# Altium project Pi4GPU_v2.PrjPcb (part 2 of 2)

## Sheet [15] Sensors.SchDoc: Measurement sensors
size A4; Engineer: M. Folejewski; DocumentNumber: 15; SheetNumber: 15; SheetTotal: 17; PageSize: A4; Designators: 900-949
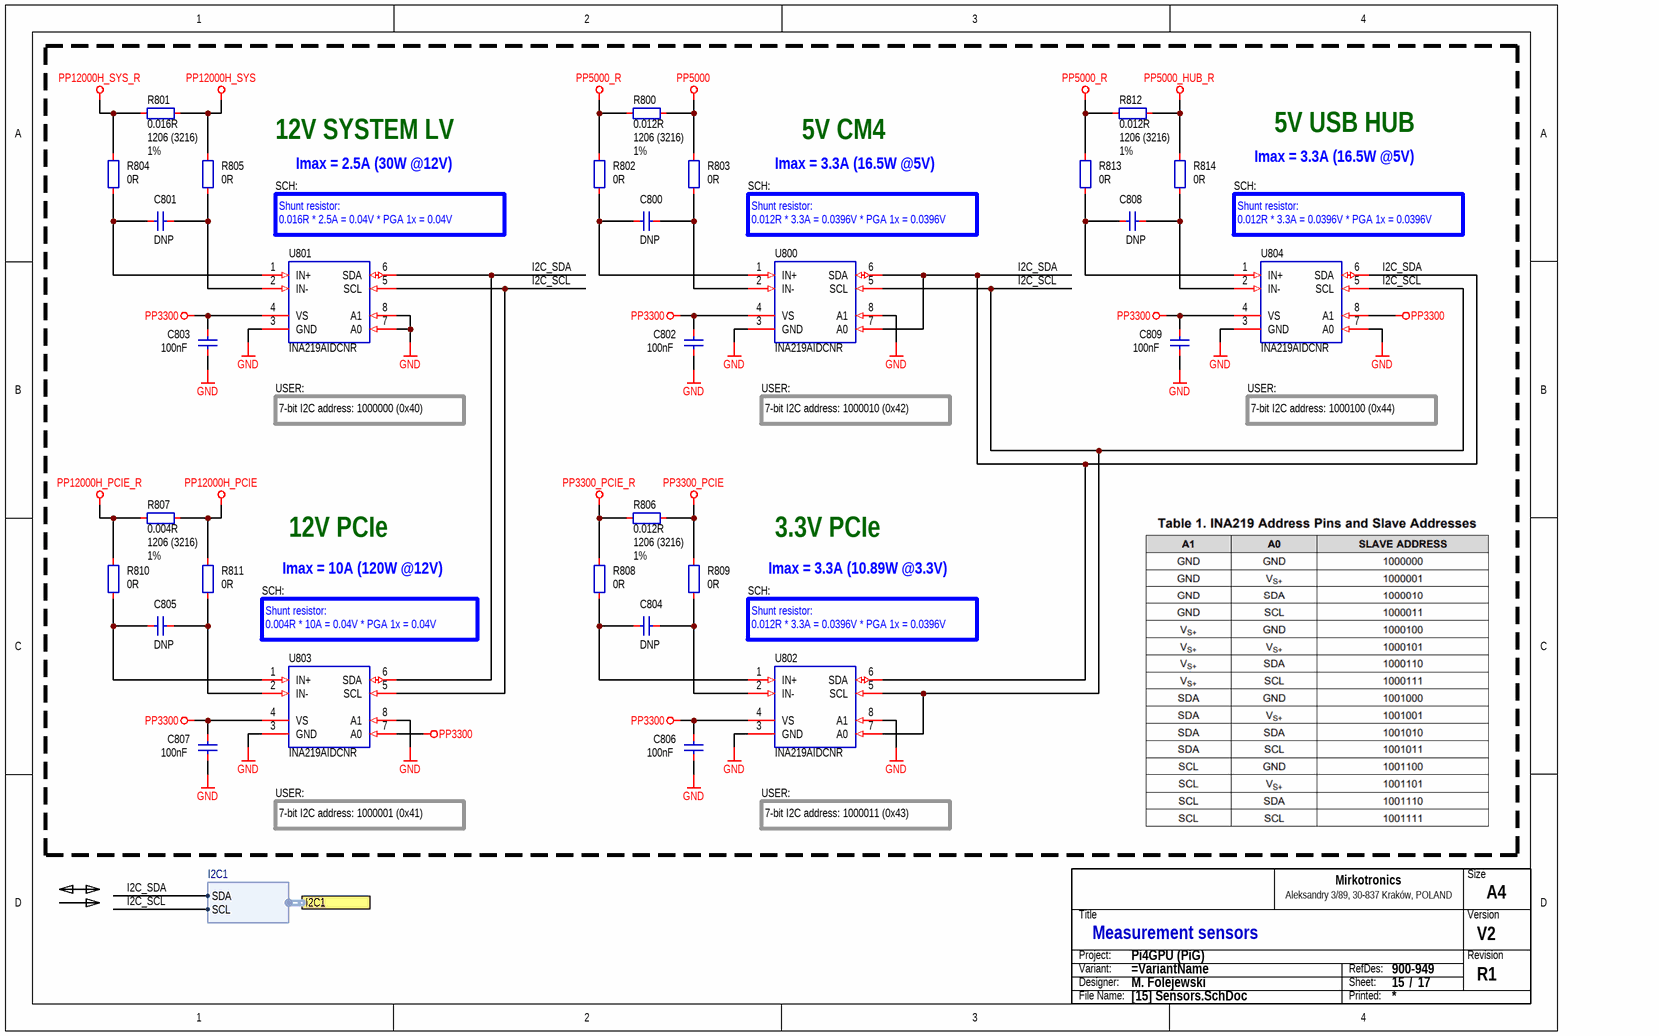
[diagram p10: [15] Sensors.SchDoc]

### Parts
(Parts that share a designator on the sheet are numbered #1, #2 ... from top to bottom, then left to right.)
C800  DNP  [CAP_0603_R]
C801  DNP  [CAP_0603_R]
C802  100nF  [CAP_0603_R]
C803  100nF  [CAP_0603_R]
C804  DNP  [CAP_0603_R]
C805  DNP  [CAP_0603_R]
C806  100nF  [CAP_0603_R]
C807  100nF  [CAP_0603_R]
C808  DNP  [CAP_0603_R]
C809  100nF  [CAP_0603_R]
R800  0.012R  Package (Case): 1206 (3216)  Tolerance: 1%  [RES_1206_R]
R801  0.016R  Package (Case): 1206 (3216)  Tolerance: 1%  [RES_1206_R]
R802  0R  [RES_0603_R]
R803  0R  [RES_0603_R]
R804  0R  [RES_0603_R]
R805  0R  [RES_0603_R]
R806  0.012R  Package (Case): 1206 (3216)  Tolerance: 1%  [RES_1206_R]
R807  0.004R  Package (Case): 1206 (3216)  Tolerance: 1%  [RES_1206_R]
R808  0R  [RES_0603_R]
R809  0R  [RES_0603_R]
R810  0R  [RES_0603_R]
R811  0R  [RES_0603_R]
R812  0.012R  Package (Case): 1206 (3216)  Tolerance: 1%  [RES_1206_R]
R813  0R  [RES_0603_R]
R814  0R  [RES_0603_R]
TB?#11  Title block  (value not drawn)  (graphical)
U800  INA219AIDCNR  [ICC_SOT23-8_290X160X100P65]
U801  INA219AIDCNR  [ICC_SOT23-8_290X160X100P65]
U802  INA219AIDCNR  [ICC_SOT23-8_290X160X100P65]
U803  INA219AIDCNR  [ICC_SOT23-8_290X160X100P65]
U804  INA219AIDCNR  [ICC_SOT23-8_290X160X100P65]

### Ports
I2C1 (harness I2C1)

### Harnesses
I2C1: SDA, SCL

### Nets
GND: C802.1 C803.1 C806.1 C807.1 C809.1 U800.3(GND) U800.8(A1) U801.3(GND) U801.7(A0) U801.8(A1) U802.3(GND) U802.8(A1) U803.3(GND) U803.8(A1) U804.3(GND) U804.7(A0)
PP3300: C802.2 C803.2 C806.2 C807.2 C809.2 U800.4(VS) U801.4(VS) U802.4(VS) U803.4(VS) U803.7(A0) U804.4(VS) U804.8(A1)
PP3300_PCIE: R806.2 R809.2
PP3300_PCIE_R: R806.1 R808.2
PP5000: R800.2 R803.2
PP5000_HUB_R: R812.2 R814.2
PP5000_R: R800.1 R802.2 R812.1 R813.2
PP12000H_PCIE: R807.2 R811.2
PP12000H_PCIE_R: R807.1 R810.2
PP12000H_SYS: R801.2 R805.2
PP12000H_SYS_R: R801.1 R804.2
I2C_SCL: U800.5(SCL) U801.5(SCL) U802.5(SCL) U802.7(A0) U803.5(SCL) U804.5(SCL) ; port I2C1.SCL  [project net CM_GPIO3]
I2C_SDA: U800.6(SDA) U800.7(A0) U801.6(SDA) U802.6(SDA) U803.6(SDA) U804.6(SDA) ; port I2C1.SDA  [project net CM_GPIO2]
NetC800_1: C800.1 R802.1 U800.1(IN+)
NetC800_2: C800.2 R803.1 U800.2(IN-)
NetC801_1: C801.1 R804.1 U801.1(IN+)
NetC801_2: C801.2 R805.1 U801.2(IN-)
NetC804_1: C804.1 R808.1 U802.1(IN+)
NetC804_2: C804.2 R809.1 U802.2(IN-)
NetC805_1: C805.1 R810.1 U803.1(IN+)
NetC805_2: C805.2 R811.1 U803.2(IN-)
NetC808_1: C808.1 R813.1 U804.1(IN+)
NetC808_2: C808.2 R814.1 U804.2(IN-)

### Notes on the sheet
- 12V SYSTEM LV
- Imax = 2.5A (30W @12V)
- Imax = 3.3A (16.5W @5V)
- 5V CM4
- 5V USB HUB
- (near U801) Shunt resistor:
  0.016R * 2.5A = 0.04V * PGA 1x = 0.04V
- SCH:
- Shunt resistor:
  0.012R * 3.3A = 0.0396V * PGA 1x = 0.0396V
- 7-bit I2C address: 1000000 (0x40)
- USER:
- 7-bit I2C address: 1000010 (0x42)
- 7-bit I2C address: 1000100 (0x44)
- Imax = 10A (120W @12V)
- 12V PCIe
- Imax = 3.3A (10.89W @3.3V)
- 3.3V PCIe
- Shunt resistor:
  0.004R * 10A = 0.04V * PGA 1x = 0.04V
- 7-bit I2C address: 1000001 (0x41)
- 7-bit I2C address: 1000011 (0x43)
- (in symbol SCH_TITLE_BLOCK_MIRKOTRONICS_V2) Size; Mirkotronics; Aleksandry 3/89, 30-837 Kraków, POLAND; Title; Version; Project:; Revision; Variant:; RefDes:; Designer:; Sheet:; /; File Name:; Printed:

### Library data of the parts
C800 C801 C804 C805 C808 = CAP-0023: as C450 on sheet [11] SD; ID: CAP-0023; Component Type: Capacitor; Component Subtype: MLCC; Value: DNP; Manufacturer: GENERIC; MPN: DNP; Mounting Type: SMD; Package (Case): 0603 (1608); Component Body: TBD; Component Height: TBD; Packaging Type: TBD; ROHS Status: TBD; Operating Temperature: TBD; Capacitance: DNP; Voltage Rating: TBD; Dielectric: TBD; Tolerance: TBD; Features: TBD; Supplier 1: LCSC
C802 C803 C806 C807 C809 = CAP-0008: as C200 on sheet [06] USB_C; Component Type: Capacitor; Component Subtype: MLCC; Value: 100nF; Manufacturer: TBD; MPN: TBD; Mounting Type: SMD; Package (Case): 0603 (1608); Supplier: ?; Supplier 1: LCSC; Supplier Part Number 1: C14663
R800 R801 R806 R807 R812 = RES-0060: Resistor; Thick Film; GENERIC; TBD; TBD; TBD; TBD; TBD; SMD; 1206 (3216);; ID: RES-0060; Component Type: Resistor; Component Subtype: Thick Film; Manufacturer: GENERIC; MPN: GENERIC; Mounting Type: SMD; Component Body: TBD; Component Height: TBD; Packaging Type: TBD; ROHS Status: TBD; Operating Temperature: TBD; Power Rating: TBD; TCR: TBD; Voltage Rating: TBD; Features: TBD; Supplier 1: LCSC
  R800 R806 R812: Value: 0.012R; Resistance: 0.012R; Supplier Part Number 1: C723448
  R801: Value: 0.016R; Resistance: 0.016R; Supplier Part Number 1: C2904218
  R807: Value: 0.004R; Resistance: 0.004R; Supplier Part Number 1: C5120913
R802-R805 R808-R811 R813 R814 = RES-0052: Resistor; Thick Film; 0R; 1%; TBD; TBD; TBD; Standard; SMD; 0603 (1608);; Component Body: 1.60 x 0.80mm; ID: RES-0052; Component Type: Resistor; Component Subtype: Thick Film; Value: 0R; Manufacturer: TBD; MPN: TBD; Mounting Type: SMD; Package (Case): 0603 (1608); Component Height: 0.45mm; Packaging Type: TBD; ROHS Status: TBD; Operating Temperature: TBD; Resistance: 0R; Tolerance: 1%; Power Rating: TBD; TCR: TBD; Voltage Rating: TBD; Features: Standard; Supplier 1: LCSC; Supplier Part Number 1: C21189
TB?#11 = SCH_TITLE_BLOCK_MIRKOTRONICS_V2: Component Type: Title block; Manufacturer: -; Mounting Type: Non component; MPN: -; Operating Temperature: -; Package: -; Specification: Title block; Value: Title block; Replacement: -; System: ?
U800-U804 = ICC_TXI_INA219_SOT23-8: IC; Current Monitor;; Manufacturer: Texas Instruments; Specification: Bidirectional Current/Power Monitor, I2C, SOT-23-8 package; Component Type: IC; Mounting Type: SMD; MPN: INA219AIDCNR; Operating Temperature: -40°C to +85°C; Package: SOT-23-8; Value: INA219AIDCNR; Component Subtype: Current monitor; Supplier 1: LCSC; Supplier Part Number 1: C87469

## Sheet [17] Changelog.SchDoc: Hardware changelog
size A4; Engineer: M. Folejewski; DocumentNumber: 17; SheetNumber: 17; SheetTotal: 17; PageSize: A4; Designators: -
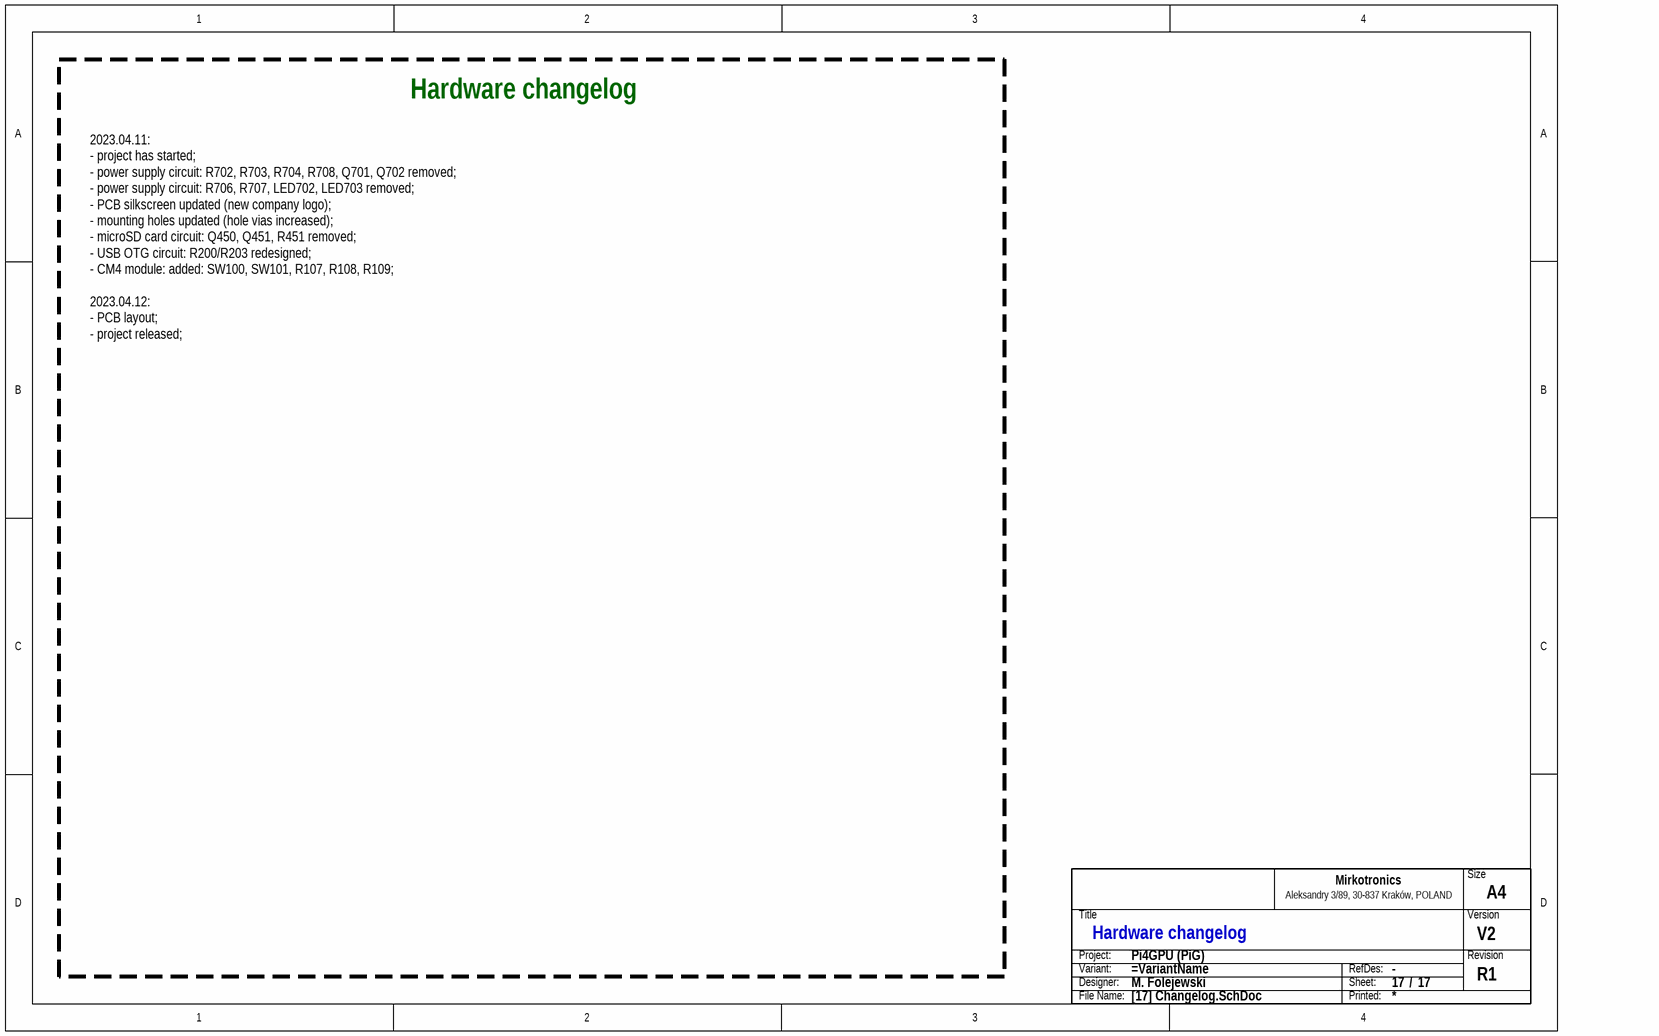
[diagram p11: [17] Changelog.SchDoc]

### Parts
(Parts that share a designator on the sheet are numbered #1, #2 ... from top to bottom, then left to right.)
TB?#12  Title block  (value not drawn)  (graphical)

### Notes on the sheet
- Hardware changelog
- 2023.04.11:
  - project has started;
  - power supply circuit: R702, R703, R704, R708, Q701, Q702 removed;
  - power supply circuit: R706, R707, LED702, LED703 removed;
  - PCB silkscreen updated (new company logo);
  - mounting holes updated (hole vias increased);
  - microSD card circuit: Q450, Q451, R451 removed;
  - USB OTG circuit: R200/R203 redesigned;
  - CM4 module: added: SW100, SW101, R107, R108, R109;
  2023.04.12:
  - PCB layout;
  - project released;
- (in symbol SCH_TITLE_BLOCK_MIRKOTRONICS_V2) Size; Mirkotronics; Aleksandry 3/89, 30-837 Kraków, POLAND; Title; Version; Project:; Revision; Variant:; RefDes:; Designer:; Sheet:; /; File Name:; Printed:

### Library data of the parts
TB?#12 = SCH_TITLE_BLOCK_MIRKOTRONICS_V2: Component Type: Title block; Manufacturer: -; Mounting Type: Non component; MPN: -; Operating Temperature: -; Package: -; Specification: Title block; Value: Title block; Replacement: -; System: ?

## Sheet [12] MISC.SchDoc: MISC
size A4; Engineer: M. Folejewski; DocumentNumber: 12; SheetNumber: 12; SheetTotal: 17; PageSize: A4; Designators: 800-899
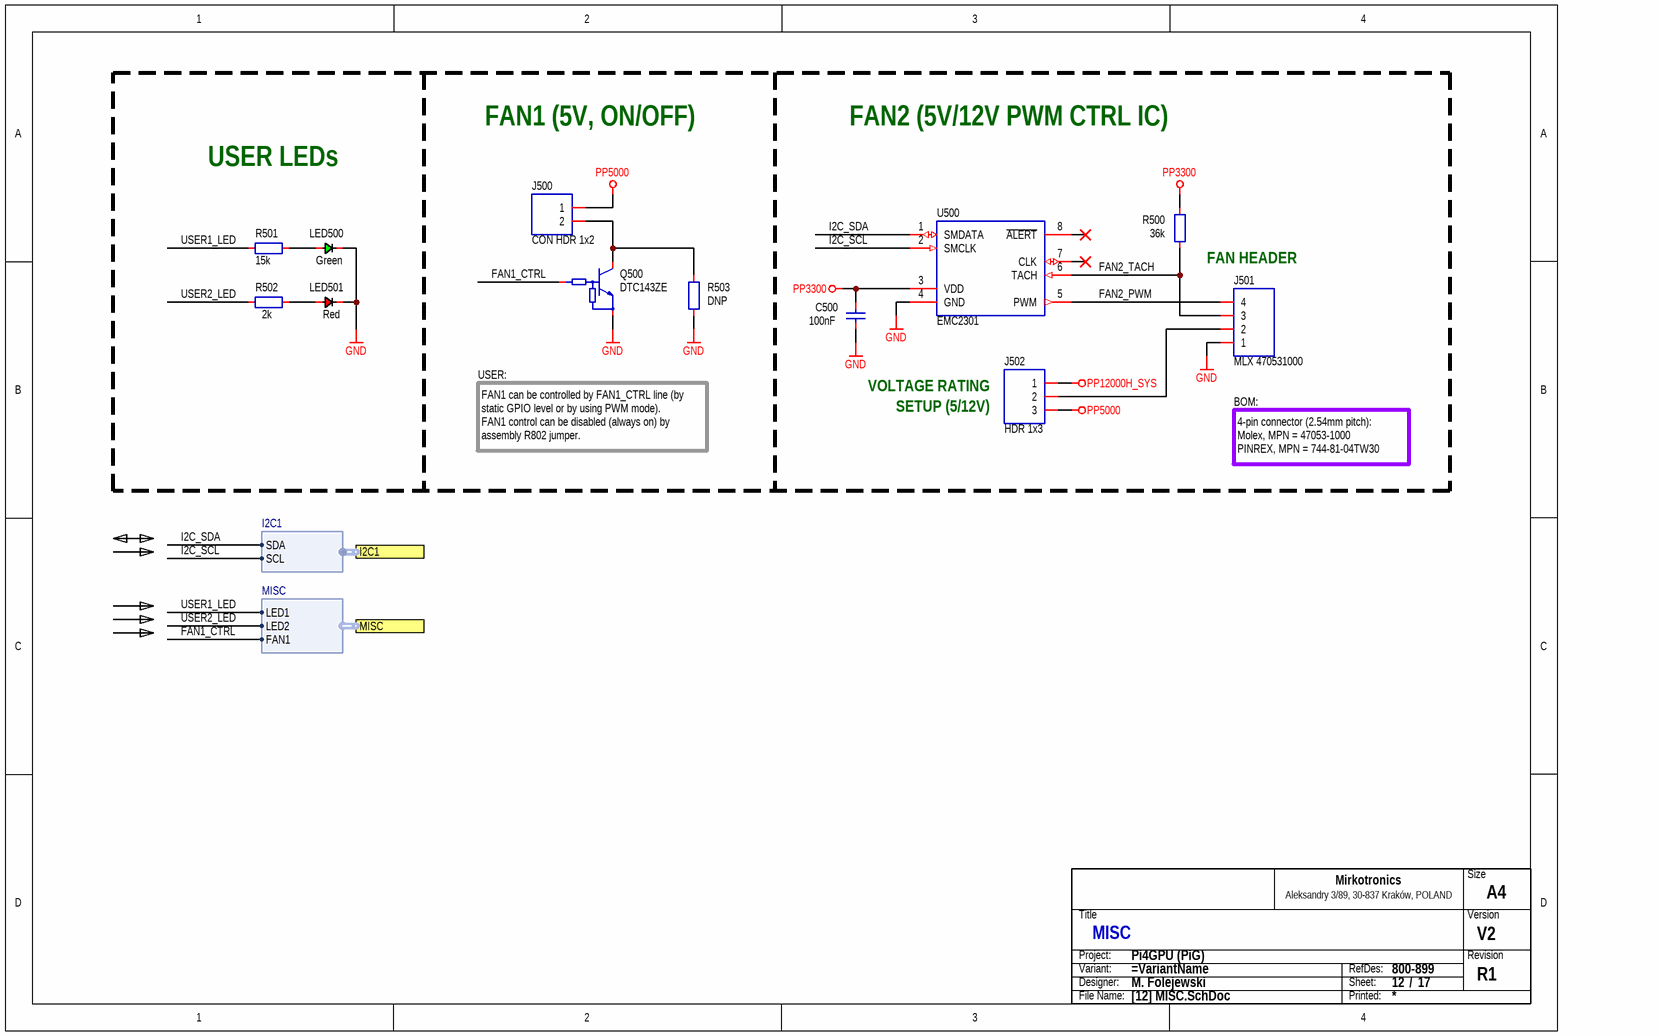
[diagram p12: [12] MISC.SchDoc]

### Parts
(Parts that share a designator on the sheet are numbered #1, #2 ... from top to bottom, then left to right.)
C500  100nF  [CAP_0603_R]
J500  CON HDR 1x2  [CON_HDR_P254_1X02_STR]
J501  MLX 470531000  [CON_MLX_470531000]
J502  HDR 1x3  [CON_HDR_P254_1X03_STR_JMP]
LED500  Green  [LED_0805_GRN_R]
LED501  Red  [LED_0805_RED_R]
Q500  DTC143ZE  [PKG_SOT523_SC75_SOT416_P100_R]
R500  36k  [RES_0603_R]
R501  15k  [RES_0603_R]
R502  2k  [RES_0603_R]
R503  DNP  [RES_0603_R]
TB?#13  Title block  (value not drawn)  (graphical)
U500  EMC2301  [ICC_TSSOP8_300X300X110P65]

### Ports
I2C1 (harness I2C1), MISC (harness MISC)

### Harnesses
MISC: LED1, LED2, FAN1
I2C1: SDA, SCL

### Nets
GND: C500.1 J501.1 LED500.1 LED501.1 Q500.2(E) R503.1 U500.4(GND)
PP3300: C500.2 R500.2 U500.3(VDD)
PP5000: J500.1 J502.3
PP12000H_SYS: J502.1
FAN1_CTRL: Q500.1(B) ; port MISC.FAN1  [project net CM_GPIO12]
FAN2_PWM: J501.4 U500.5(PWM)
FAN2_TACH: J501.3 R500.1 U500.6(TACH)
I2C_SCL: U500.2(SMCLK) ; port I2C1.SCL  [project net CM_GPIO3]
I2C_SDA: U500.1(SMDATA) ; port I2C1.SDA  [project net CM_GPIO2]
USER1_LED: R501.1 ; port MISC.LED1  [project net CM_GPIO22]
USER2_LED: R502.1 ; port MISC.LED2  [project net CM_GPIO27]
NetJ500_2: J500.2 Q500.3(C) R503.2
NetJ501_2: J501.2 J502.2
NetLED500_2: LED500.2 R501.2
NetLED501_2: LED501.2 R502.2

Not connected (* = marked no-connect by the designer): U500 7(CLK)* 8(~{ALERT})*

### Notes on the sheet
- USER LEDs
- FAN1 (5V, ON/OFF)
- FAN2 (5V/12V PWM CTRL IC)
- FAN HEADER
- USER:
- FAN1 can be controlled by FAN1_CTRL line (by static GPIO level or by using PWM mode).
  FAN1 control can be disabled (always on) by assembly R802 jumper.
- VOLTAGE RATING
- SETUP (5/12V)
- BOM:
- 4-pin connector (2.54mm pitch):
  Molex, MPN = 47053-1000
  PINREX, MPN = 744-81-04TW30
- (in symbol SCH_TITLE_BLOCK_MIRKOTRONICS_V2) Size; Mirkotronics; Aleksandry 3/89, 30-837 Kraków, POLAND; Title; Version; Project:; Revision; Variant:; RefDes:; Designer:; Sheet:; /; File Name:; Printed:

### Library data of the parts
C500 = CAP-0008: as C200 on sheet [06] USB_C; Component Type: Capacitor; Component Subtype: MLCC; Value: 100nF; Manufacturer: TBD; MPN: TBD; Mounting Type: SMD; Package (Case): 0603 (1608); Supplier: ?; Supplier 1: LCSC; Supplier Part Number 1: C14663
J500 = CON-0020: Connector; Pin Header; 1 x 2 pins; 2.54mm; Male; TBD; TBD; THT; THT;; Manufacturer: GENERIC; Component Type: Connector; Component Subtype: Pin Header; Value: CON HDR 1x2; MPN: GENERIC; Mounting Type: THT; Package (Case): THT; Supplier: ?; Supplier 1: LCSC; Supplier Part Number 1: C492401
J501 = CON_1X04_COL: Connector; 1 Row;; Manufacturer: Molex; Component Subtype: Pin header; Package (Case): THT; Component Type: Connector; Mounting Type: THT; MPN: 470531000; Value: MLX 470531000; Supplier 1: LCSC; Supplier Part Number 1: C402779
J502 = CON_1X03_COL: Connector; 1 Row;; Manufacturer: GENERIC; Component Subtype: Pin Header; Package (Case): THT; Value: HDR 1x3; MPN: GENERIC; Component Type: Connector; Mounting Type: THT; Supplier: ?; Supplier 1: LCSC; Supplier Part Number 1: C49257
LED500 = DIO_LED_GRN: as LED100 on sheet [04] CM4_PART1; Value: Green; Component Type: LED; Mounting Type: SMD; Supplier: LCSC; Supplier 1: LCSC; Supplier Part Number 1: C84260
LED501 = DIO_LED_RED: Diode; LED; Red;; Manufacturer: Foshan NationStar Optoelectronics; MPN: NCD0805R1; Component Subtype: LED Diode; Package (Case): 0805 (2012); Value: Red; Component Type: LED; Mounting Type: SMD; Supplier: LCSC; Supplier 1: LCSC; Supplier Part Number 1: C84256
Q500 = TRA_BJT_NPN_DIG_BEC: Transistor; BJT; NPN; Digital;; Component Subtype: NPN Transistor; Value: DTC143ZE; MPN: DTC143ZE; Component Type: Transistor; Mounting Type: SMD; Supplier: ?; Supplier 1: LCSC; Supplier Part Number 1: C248787
R500 R503 = RES-0054: as R300 on sheet [08] PCIe; Component Type: Resistor; Component Subtype: Thick Film; Manufacturer: GENERIC; MPN: GENERIC; Mounting Type: SMD; Package (Case): 0603 (1608); Supplier: ?; Supplier 1: LCSC
  R500: Value: 36k; Supplier Part Number 1: C23147
  R503: Value: DNP
R501 = RES-0043: as R105 on sheet [04] CM4_PART1; Component Type: Resistor; Component Subtype: Thick Film; Value: 15k; Mounting Type: SMD; Package (Case): 0603 (1608); Supplier: ?; Supplier 1: LCSC; Supplier Part Number 1: C22809
R502 = RES-0033: Resistor; Thick Film; 2k2; 1%; 100mW; 100PPM; 75V; Standard; SMD; 0603 (1608);; Manufacturer: Yageo Corporation; MPN: TBD; Component Type: Resistor; Component Subtype: Thick Film; Value: 2k; Mounting Type: SMD; Package (Case): 0603 (1608); Supplier: ?; Supplier 1: LCSC; Supplier Part Number 1: C22975
TB?#13 = SCH_TITLE_BLOCK_MIRKOTRONICS_V2: Component Type: Title block; Manufacturer: -; Mounting Type: Non component; MPN: -; Operating Temperature: -; Package: -; Specification: Title block; Value: Title block; Replacement: -; System: ?
U500 = ICC_MCP_EMC2301_MSOP-8: IC; Fan controller;; Manufacturer: Microchip Technology; MPN: EMC2301-1-ACZL-TR; Package (Case): MSOP-8; Component Subtype: Fan controller; Component Type: IC; Mounting Type: SMD; Value: EMC2301; Supplier 1: LCSC; Supplier Part Number 1: C148036

## Sheet [09] HDMI.SchDoc: HDMI Interface
size A4; Engineer: M. Folejewski; DocumentNumber: 9; SheetNumber: 9; SheetTotal: 17; PageSize: A4; Designators: 400-449
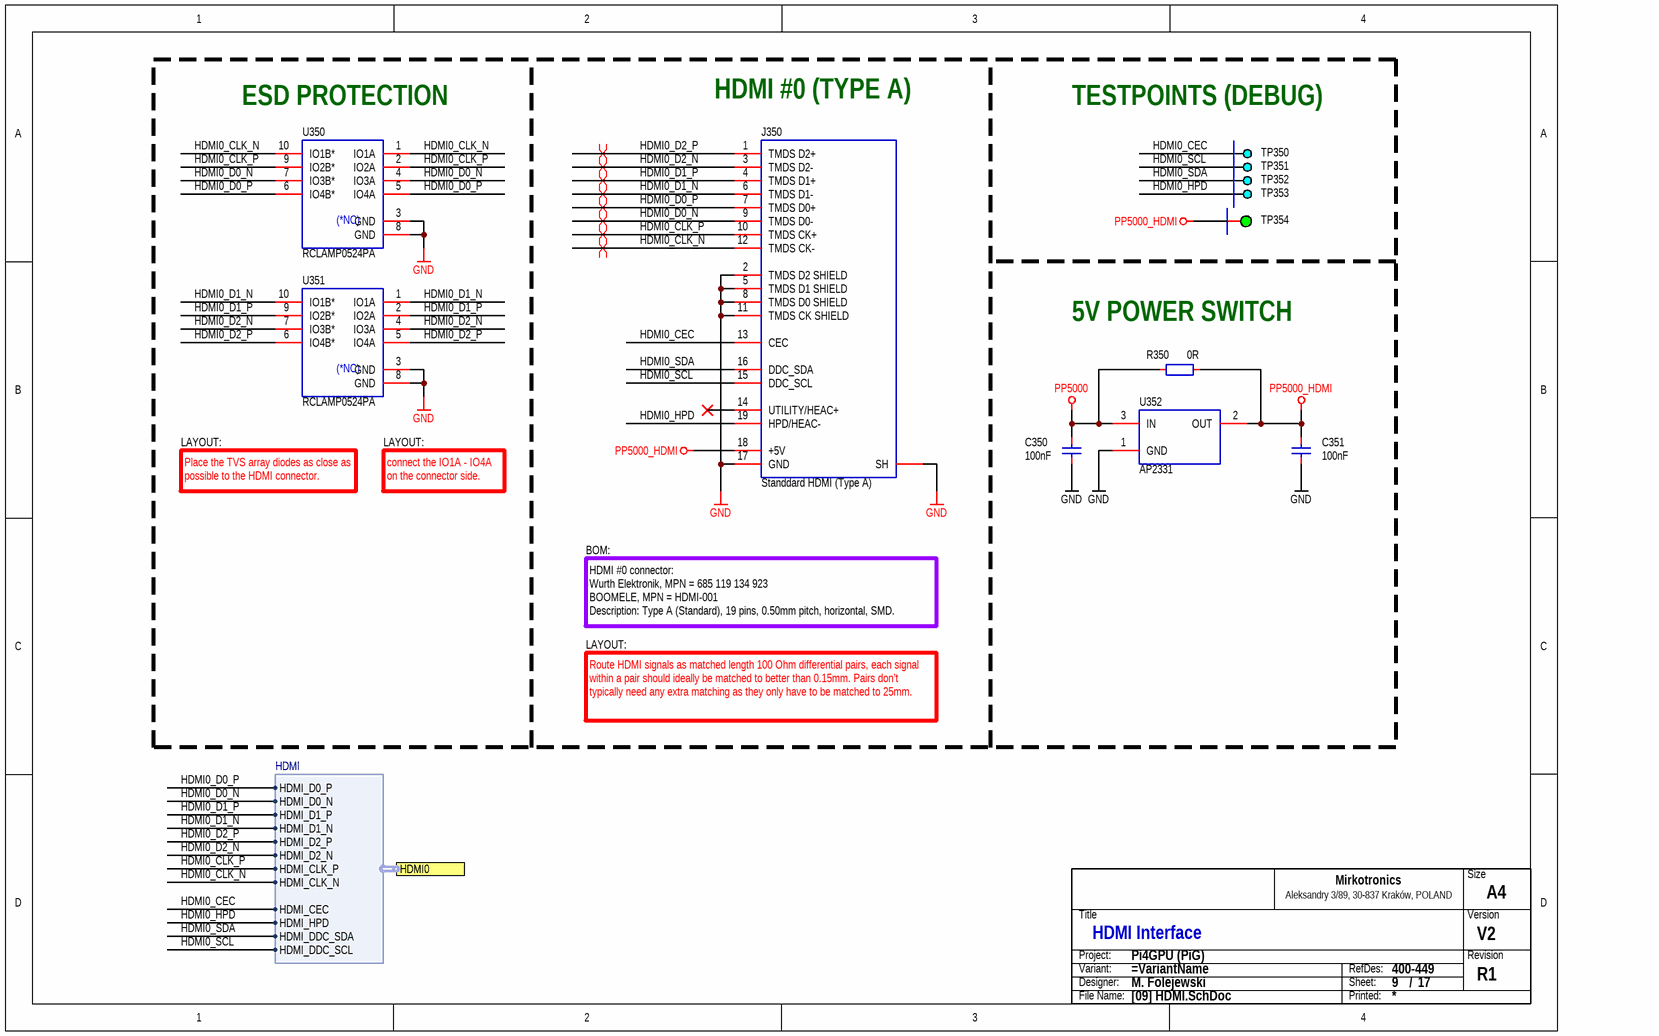
[diagram p13: [09] HDMI.SchDoc]

### Parts
(Parts that share a designator on the sheet are numbered #1, #2 ... from top to bottom, then left to right.)
C350  100nF  [CAP_0603_R]
C351  100nF  [CAP_0603_R]
J350  Standdard HDMI (Type A)  [CON_HDMI_STD]
R350  0R  [RES_0603_R]
TB?#14  Title block  (value not drawn)  (graphical)
TP350  DEBUG  [PCB_TP_DBG_50]  (value not drawn)  (no BOM)
TP351  DEBUG  [PCB_TP_DBG_50]  (value not drawn)  (no BOM)
TP352  DEBUG  [PCB_TP_DBG_50]  (value not drawn)  (no BOM)
TP353  DEBUG  [PCB_TP_DBG_50]  (value not drawn)  (no BOM)
TP354  ICT  [PCB_TP_ICT_100]  (value not drawn)  (no BOM)
U350  RCLAMP0524PA  [ICC_SLP2510P8_250X100X60_P50_R]
U351  RCLAMP0524PA  [ICC_SLP2510P8_250X100X60_P50_R]
U352  AP2331  [PKG_SOT23-3L_SC59_P190_R]

### Ports
HDMI0 (harness HDMI)

### Harnesses
HDMI: HDMI_D0_P, HDMI_D0_N, HDMI_D1_P, HDMI_D1_N, HDMI_CEC, HDMI_DDC_SDA, HDMI_D2_P, HDMI_D2_N, HDMI_CLK_P, HDMI_CLK_N, HDMI_DDC_SCL, HDMI_HPD

### Nets
GND: C350.1 C351.1 J350.2(TMDS_D2_SHIELD) J350.5(TMDS_D1_SHIELD) J350.8(TMDS_D0_SHIELD) J350.11(TMDS_CK_SHIELD) J350.17(GND) J350.SH U350.3(GND) U350.8(GND) U351.3(GND) U351.8(GND) U352.1(GND)
PP5000: C350.2 R350.2 U352.3(IN)
PP5000_HDMI: C351.2 J350.18(+5V) R350.1 TP354.1 U352.2(OUT)
HDMI0_CEC: J350.13(CEC) TP350.1 ; port HDMI0.HDMI_CEC  [project net CM_HDMI0_CEC]
HDMI0_CLK_N: J350.12(TMDS_CK-) U350.1(IO1A) U350.10(IO1B*) ; port HDMI0.HDMI_CLK_N  [project net CM_HDMI0_CLK_N]
HDMI0_CLK_P: J350.10(TMDS_CK+) U350.2(IO2A) U350.9(IO2B*) ; port HDMI0.HDMI_CLK_P  [project net CM_HDMI0_CLK_P]
HDMI0_D0_N: J350.9(TMDS_D0-) U350.4(IO3A) U350.7(IO3B*) ; port HDMI0.HDMI_D0_N  [project net CM_HDMI0_D0_N]
HDMI0_D0_P: J350.7(TMDS_D0+) U350.5(IO4A) U350.6(IO4B*) ; port HDMI0.HDMI_D0_P  [project net CM_HDMI0_D0_P]
HDMI0_D1_N: J350.6(TMDS_D1-) U351.1(IO1A) U351.10(IO1B*) ; port HDMI0.HDMI_D1_N  [project net CM_HDMI0_D1_N]
HDMI0_D1_P: J350.4(TMDS_D1+) U351.2(IO2A) U351.9(IO2B*) ; port HDMI0.HDMI_D1_P  [project net CM_HDMI0_D1_P]
HDMI0_D2_N: J350.3(TMDS_D2-) U351.4(IO3A) U351.7(IO3B*) ; port HDMI0.HDMI_D2_N  [project net CM_HDMI0_D2_N]
HDMI0_D2_P: J350.1(TMDS_D2+) U351.5(IO4A) U351.6(IO4B*) ; port HDMI0.HDMI_D2_P  [project net CM_HDMI0_D2_P]
HDMI0_HPD: J350.19(HPD/HEAC-) TP353.1 ; port HDMI0.HDMI_HPD  [project net CM_HDMI0_HPD]
HDMI0_SCL: J350.15(DDC_SCL) TP351.1 ; port HDMI0.HDMI_DDC_SCL  [project net CM_HDMI0_SCL]
HDMI0_SDA: J350.16(DDC_SDA) TP352.1 ; port HDMI0.HDMI_DDC_SDA  [project net CM_HDMI0_SDA]

Not connected (* = marked no-connect by the designer): J350 14(UTILITY/HEAC+)*

### Layout directives
differential pair: CM_HDMI0_CLK_N, CM_HDMI0_CLK_P, CM_HDMI0_D0_N, CM_HDMI0_D0_P, CM_HDMI0_D1_N, CM_HDMI0_D1_P, CM_HDMI0_D2_N, CM_HDMI0_D2_P

### Notes on the sheet
- (near U350) ESD PROTECTION
- (near J350) HDMI #0 (TYPE A)
- TESTPOINTS (DEBUG)
- (near R350) 5V POWER SWITCH
- LAYOUT:
- Place the TVS array diodes as close as possible to the HDMI connector.
- connect the IO1A - IO4A on the connector side.
- BOM:
- HDMI #0 connector:
  Wurth Elektronik, MPN = 685 119 134 923
  BOOMELE, MPN = HDMI-001
  Description: Type A (Standard), 19 pins, 0.50mm pitch, horizontal, SMD.
- Route HDMI signals as matched length 100 Ohm differential pairs, each signal within a pair should ideally be matched to better than 0.15mm. Pairs don’t typically need any extra matching as they only have to be matched to 25mm.
- (in symbol ICC-0005) (*NC)
- (in symbol SCH_TITLE_BLOCK_MIRKOTRONICS_V2) Size; Mirkotronics; Aleksandry 3/89, 30-837 Kraków, POLAND; Title; Version; Project:; Revision; Variant:; RefDes:; Designer:; Sheet:; /; File Name:; Printed:

### Library data of the parts
C350 C351 = CAP-0008: as C200 on sheet [06] USB_C; Component Type: Capacitor; Component Subtype: MLCC; Value: 100nF; Manufacturer: TBD; MPN: TBD; Mounting Type: SMD; Package (Case): 0603 (1608); Supplier: ?; Supplier 1: LCSC; Supplier Part Number 1: C14663
J350 = CON_HDMI_1.4+_A2: Connector; HDMI v1.4+;; MPN: HDMI-001; Manufacturer: BOOMELE; Package (Case): SMD; Value: Standdard HDMI (Type A); Component Subtype: HDMI (Type A); Component Type: Connector; Mounting Type: SMD; Supplier: ?; Supplier 1: LCSC; Supplier Part Number 1: C138388
R350 = RES-0054: as R300 on sheet [08] PCIe; Component Type: Resistor; Component Subtype: Thick Film; Value: 0R; Manufacturer: GENERIC; MPN: GENERIC; Mounting Type: SMD; Package (Case): 0603 (1608); Supplier: ?; Supplier 1: LCSC; Supplier Part Number 1: C21189
TB?#14 = SCH_TITLE_BLOCK_MIRKOTRONICS_V2: Component Type: Title block; Manufacturer: -; Mounting Type: Non component; MPN: -; Operating Temperature: -; Package: -; Specification: Title block; Value: Title block; Replacement: -; System: ?
TP350-TP353 = PCB_TP_DBG: PCB Marking; Test Point (Debug);; Value: DEBUG; Component Subtype: -; Component Type: Testpoint; Mounting Type: -; Supplier: ?
TP354 = PCB_TP_ICT: as TP112 on sheet [04] CM4_PART1; Component Type: Testpoint (for ICT); Manufacturer: -; Mounting Type: Non component; MPN: -; Value: ICT
U350 U351 = ICC-0005: as U201 on sheet [06] USB_C; Component Type: IC; Component Subtype: TVS Arrays; Value: RCLAMP0524PA; Mounting Type: SMD; Package (Case): TBD; Supplier: ?; Supplier 1: LCSC; Supplier Part Number 1: C40960
U352 = ICC-0008: IC; Power Switcher; TBD TBD; SMD; SC59;; Manufacturer: Diodes Incorporated; MPN: AP2331W-7; Component Type: IC; Component Subtype: Power Switcher; Value: AP2331; Mounting Type: SMD; Package (Case): SC59; Supplier: ?; Supplier 1: LCSC; Supplier Part Number 1: C460346

## Sheet [07] USB_HUB.SchDoc: 2-port USB 2.0 hub
size A4; Engineer: M. Folejewski; DocumentNumber: 7; SheetNumber: 7; SheetTotal: 17; PageSize: A4; Designators: 250-299
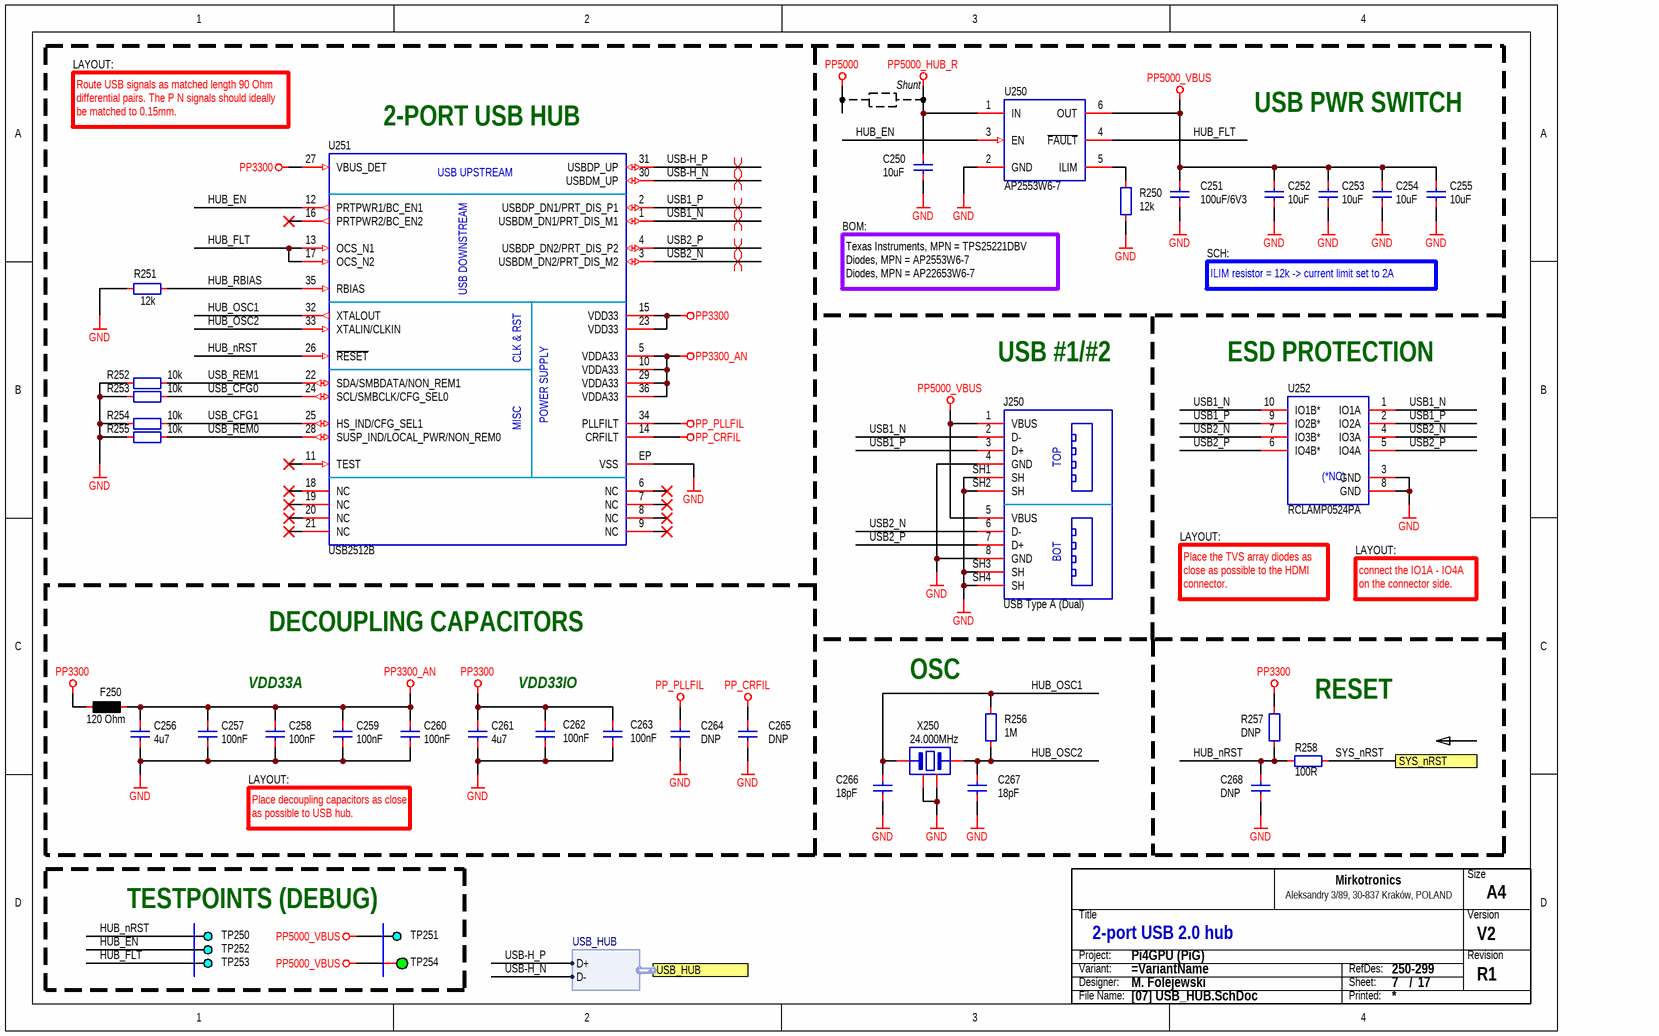
[diagram p14: [07] USB_HUB.SchDoc]

### Parts
(Parts that share a designator on the sheet are numbered #1, #2 ... from top to bottom, then left to right.)
C250  10uF  [CAP_0603_R]
C251  100uF/6V3  [CAP_1206_R]
C252  10uF  [CAP_0603_R]
C253  10uF  [CAP_0603_R]
C254  10uF  [CAP_0603_R]
C255  10uF  [CAP_0603_R]
C256  4u7  [CAP_0603_R]
C257  100nF  [CAP_0603_R]
C258  100nF  [CAP_0603_R]
C259  100nF  [CAP_0603_R]
C260  100nF  [CAP_0603_R]
C261  4u7  [CAP_0603_R]
C262  100nF  [CAP_0603_R]
C263  100nF  [CAP_0603_R]
C264  DNP  [CAP_0603_R]
C265  DNP  [CAP_0603_R]
C266  18pF  [CAP_0603_R]
C267  18pF  [CAP_0603_R]
C268  DNP  [CAP_0603_R]
F250  120 Ohm  [FER_0603_R]
J250  USB Type A (Dual)  [CON_USB_TYPE_A_2X]
R250  12k  [RES_0603_R]
R251  12k  [RES_0603_R]
R252  10k  [RES_0603_R]
R253  10k  [RES_0603_R]
R254  10k  [RES_0603_R]
R255  10k  [RES_0603_R]
R256  1M  [RES_0603_R]
R257  DNP  [RES_0603_R]
R258  100R  [RES_0603_R]
TB?#15  Title block  (value not drawn)  (graphical)
TP250  DEBUG  [PCB_TP_DBG_50]  (value not drawn)  (no BOM)
TP251  DEBUG  [PCB_TP_DBG_50]  (value not drawn)  (no BOM)
TP252  DEBUG  [PCB_TP_DBG_50]  (value not drawn)  (no BOM)
TP253  DEBUG  [PCB_TP_DBG_50]  (value not drawn)  (no BOM)
TP254  ICT  [PCB_TP_ICT_100]  (value not drawn)  (no BOM)
U250  AP2553W6-7  [PKG_SOT23-6]
U251  USB2512B  [ICC_QFN36_600X600X100_P50_EP_R]
U252  RCLAMP0524PA  [ICC_SLP2510P8_250X100X60_P50_R]
X250  24.000MHz  [OSC_3225_4P_R]

### Ports
SYS_nRST, USB_HUB (harness USB_HUB)

### Harnesses
USB_HUB: D+, D-

### Nets
GND: C250.1 C251.1 C252.1 C253.1 C254.1 C255.1 C256.1 C257.1 C258.1 C259.1 C260.1 C261.1 C262.1 C263.1 C264.1 C265.1 C266.1 C267.1 C268.1 J250.4(GND) J250.8(GND) J250.SH1(SH) J250.SH2(SH) J250.SH3(SH) J250.SH4(SH) R250.1 R251.1 R252.1 R253.1 R254.1 R255.1 U250.2(GND) U251.EP(VSS) U252.3(GND) U252.8(GND) X250.2 X250.4
PP3300: C261.2 C262.2 C263.2 F250.1 R257.2 U251.15(VDD33) U251.23(VDD33) U251.27(VBUS_DET)
PP3300_AN: C256.2 C257.2 C258.2 C259.2 C260.2 F250.2 U251.5(VDDA33) U251.10(VDDA33) U251.29(VDDA33) U251.36(VDDA33)
PP5000_HUB_R: C250.2 U250.1(IN)
PP5000_VBUS: C251.2 C252.2 C253.2 C254.2 C255.2 J250.1(VBUS) J250.5(VBUS) TP251.1 TP254.1 U250.6(OUT)
PP_CRFIL: C265.2 U251.14(CRFILT)
PP_PLLFIL: C264.2 U251.34(PLLFILT)
HUB_EN: TP252.1 U250.3(EN) U251.12(PRTPWR1/BC_EN1)
HUB_FLT: TP253.1 U250.4(~{FAULT}) U251.13(OCS_N1) U251.17(OCS_N2)
HUB_nRST: C268.2 R257.1 R258.1 TP250.1 U251.26(~{RESET})
HUB_OSC1: C266.2 R256.2 U251.32(XTALOUT) X250.1
HUB_OSC2: C267.2 R256.1 U251.33(XTALIN/CLKIN) X250.3
HUB_RBIAS: R251.2 U251.35(RBIAS)
SYS_nRST: R258.2 ; port SYS_nRST
USB1_N: J250.2(D-) U251.1(USBDM_DN1/PRT_DIS_M1) U252.1(IO1A) U252.10(IO1B*)
USB1_P: J250.3(D+) U251.2(USBDP_DN1/PRT_DIS_P1) U252.2(IO2A) U252.9(IO2B*)
USB2_N: J250.6(D-) U251.3(USBDM_DN2/PRT_DIS_M2) U252.4(IO3A) U252.7(IO3B*)
USB2_P: J250.7(D+) U251.4(USBDP_DN2/PRT_DIS_P2) U252.5(IO4A) U252.6(IO4B*)
USB-H_N: U251.30(USBDM_UP) ; port USB_HUB.D-
USB-H_P: U251.31(USBDP_UP) ; port USB_HUB.D+
USB_CFG0: R253.2 U251.24(SCL/SMBCLK/CFG_SEL0)
USB_CFG1: R254.2 U251.25(HS_IND/CFG_SEL1)
USB_REM0: R255.2 U251.28(SUSP_IND/LOCAL_PWR/NON_REM0)
USB_REM1: R252.2 U251.22(SDA/SMBDATA/NON_REM1)
NetR250_2: R250.2 U250.5(ILIM)

Not connected (* = marked no-connect by the designer): U251 6(NC)* 7(NC)* 8(NC)* 9(NC)* 11(TEST)* 16(PRTPWR2/BC_EN2)* 18(NC)* 19(NC)* 20(NC)* 21(NC)*

### Layout directives
differential pair: USB1_N, USB1_P, USB2_N, USB2_P, USB-H_N, USB-H_P

### Notes on the sheet
- LAYOUT:
- Shunt
- USB PWR SWITCH
- Route USB signals as matched length 90 Ohm differential pairs. The P N signals should ideally be matched to 0.15mm.
- (near U251) 2-PORT USB HUB
- BOM:
- Texas Instruments, MPN = TPS25221DBV
  Diodes, MPN = AP2553W6-7
  Diodes, MPN = AP22653W6-7
- ILIM resistor = 12k -> current limit set to 2A
- SCH:
- USB #1/#2
- (near U252) ESD PROTECTION
- DECOUPLING CAPACITORS
- Place the TVS array diodes as close as possible to the HDMI connector.
- connect the IO1A - IO4A on the connector side.
- VDD33A
- VDD33IO
- (near R256) OSC
- RESET
- Place decoupling capacitors as close as possible to USB hub.
- TESTPOINTS (DEBUG)
- (in symbol CON-0009) TOP; BOT
- (in symbol ICC-0005) (*NC)
- (in symbol ICC_MCP_USB2512B_QFN36) USB UPSTREAM; USB DOWNSTREAM; CLK & RST; POWER SUPPLY; MISC
- (in symbol SCH_TITLE_BLOCK_MIRKOTRONICS_V2) Size; Mirkotronics; Aleksandry 3/89, 30-837 Kraków, POLAND; Title; Version; Project:; Revision; Variant:; RefDes:; Designer:; Sheet:; /; File Name:; Printed:

### Library data of the parts
C250 C252-C256 C261 = CAP-0023: Capacitor; MLCC; GENERIC; TBD; TBD; TBD; TBD; SMD; 0603 (1608);; Component Type: Capacitor; Component Subtype: MLCC; Manufacturer: GENERIC; MPN: GENERIC; Mounting Type: SMD; Package (Case): 0603 (1608); Supplier: ?; Supplier 1: LCSC
  C250 C252-C255: Value: 10uF; Supplier Part Number 1: C19702
  C256 C261: Value: 4u7; Supplier Part Number 1: C19666
C251 = CAP-0025: Capacitor; MLCC; GENERIC; TBD; TBD; TBD; TBD; SMD; 1206 (3216);; Component Type: Capacitor; Component Subtype: MLCC; Value: 100uF/6V3; Manufacturer: GENERIC; MPN: GENERIC; Mounting Type: SMD; Package (Case): 1206 (3216); Supplier: ?; Supplier 1: LCSC; Supplier Part Number 1: C15008
C257-C260 C262 C263 = CAP-0008: Capacitor; MLCC; 100nF; TBD; TBD; TBD; TBD; SMD; 0603 (1608);; Component Type: Capacitor; Component Subtype: MLCC; Value: 100nF; Manufacturer: TBD; MPN: TBD; Mounting Type: SMD; Package (Case): 0603 (1608); Supplier: ?; Supplier 1: LCSC; Supplier Part Number 1: C14663
C264 C265 C268 = CAP-0018: Capacitor; MLCC; DNP; TBD; TBD; TBD; DO NOT PLACE; SMD; 0603 (1608);; Component Type: Capacitor; Component Subtype: MLCC; Value: DNP; Manufacturer: DNP; MPN: DNP; Mounting Type: SMD; Package (Case): 0603 (1608); Supplier: ?; Supplier 1: LCSC
C266 C267 = CAP-0020: Capacitor; MLCC; 18pF; TBD; TBD; TBD; TBD; SMD; 0603 (1608);; Component Type: Capacitor; Component Subtype: MLCC; Value: 18pF; Manufacturer: TBD; MPN: TBD; Mounting Type: SMD; Package (Case): 0603 (1608); Supplier: ?; Supplier 1: LCSC; Supplier Part Number 1: C1647
F250 = FIL-0001: Inductor; Ferrite Bead; 120 Ohm; 2000mA; TBD; TBD; TBD; SMD; 0603 (1608);; Component Type: Inductor; Component Subtype: Ferrite Bead; Value: 120 Ohm; Manufacturer: TBD; MPN: TBD; Mounting Type: SMD; Package (Case): 0603 (1608); Supplier: ?; Supplier 1: LCSC; Supplier Part Number 1: C62708
J250 = CON-0009: Connector; USB Type A (Dual); 2 x 4 pins; TBD; TBD; TBD; TBD; THT; THT;; Component Type: Connector; Component Subtype: USB Type A (Dual); Value: USB Type A (Dual); Manufacturer: TBD; MPN: TBD; Mounting Type: THT; Package (Case): THT; Supplier: ?; Supplier 1: LCSC; Supplier Part Number 1: C456021
R250 = RES-0054: Resistor; Thick Film; GENERIC; TBD; TBD; TBD; TBD; TBD; SMD; 0603 (1608);; Component Type: Resistor; Component Subtype: Thick Film; Value: 12k; Manufacturer: GENERIC; MPN: GENERIC; Mounting Type: SMD; Package (Case): 0603 (1608); Supplier: ?; Supplier 1: LCSC; Supplier Part Number 1: C22790
R251 = RES-0053: Resistor; Thick Film; 12k; 1%; 100mW; 100PPM; 75V; Standard; SMD; 0603 (1608);; Manufacturer: Yageo Corporation; MPN: TBD; Component Type: Resistor; Component Subtype: Thick Film; Value: 12k; Mounting Type: SMD; Package (Case): 0603 (1608); Supplier: ?; Supplier 1: LCSC; Supplier Part Number 1: C22790
R252-R255 = RES-0028: Resistor; Thick Film; 10k; 1%; 100mW; 100PPM; 75V; Standard; SMD; 0603 (1608);; Manufacturer: Yageo Corporation; MPN: RC0603FR-0710KL; Component Type: Resistor; Component Subtype: Thick Film; Value: 10k; Mounting Type: SMD; Package (Case): 0603 (1608); Supplier: ?; Supplier 1: LCSC; Supplier Part Number 1: C98220
R256 = RES-0050: Resistor; Thick Film; 1M; 1%; 100mW; 100PPM; 75V; Standard; SMD; 0603 (1608);; Manufacturer: Yageo Corporation; MPN: TBD; Component Type: Resistor; Component Subtype: Thick Film; Value: 1M; Mounting Type: SMD; Package (Case): 0603 (1608); Supplier: ?; Supplier 1: LCSC; Supplier Part Number 1: C22935
R257 = RES-0051: Resistor; Thick Film; DNP; TBD; TBD; TBD; TBD; DO NOT PLACE; SMD; 0603 (1608);; Component Type: Resistor; Component Subtype: Thick Film; Value: DNP; Manufacturer: TBD; MPN: TBD; Mounting Type: SMD; Package (Case): 0603 (1608); Supplier: ?; Supplier 1: LCSC
R258 = RES-0026: Resistor; Thick Film; 100R; 1%; 100mW; 100PPM; 75V; Standard; SMD; 0603 (1608);; Manufacturer: Yageo Corporation; MPN: TBD; Component Type: Resistor; Component Subtype: Thick Film; Value: 100R; Mounting Type: SMD; Package (Case): 0603 (1608); Supplier: ?; Supplier 1: LCSC; Supplier Part Number 1: C22775
TB?#15 = SCH_TITLE_BLOCK_MIRKOTRONICS_V2: Component Type: Title block; Manufacturer: -; Mounting Type: Non component; MPN: -; Operating Temperature: -; Package: -; Specification: Title block; Value: Title block; Replacement: -; System: ?
TP250-TP253 = PCB_TP_DBG: PCB Marking; Test Point (Debug);; Value: DEBUG; Component Subtype: -; Component Type: Testpoint; Mounting Type: -; Supplier: ?
TP254 = PCB_TP_ICT: Test Point (ICT); Specification: Testpoint (for ICT), SMD pad; Component Type: Testpoint (for ICT); Manufacturer: -; Mounting Type: Non component; MPN: -; Value: ICT
U250 = ICC_TXI_TPS25221_DBV: IC; Current Limited Switch;; Manufacturer: Diodes Incorporated; Package (Case): SOT26; MPN: AP2553W6-7; Value: AP2553W6-7; Component Subtype: Current Limited Switch; Component Type: IC; Mounting Type: SMD; Supplier: ?; Supplier 1: LCSC; Supplier Part Number 1: C212302
U251 = ICC_MCP_USB2512B_QFN36: IC; USB Hub;; Manufacturer: Microchip Technology; Component Subtype: USB Hub; Component Type: IC; Mounting Type: SMD; MPN: USB2512B; Supplier: ?; Value: USB2512B; Supplier 1: LCSC; Supplier Part Number 1: C626658
U252 = ICC-0005: IC; TVS Arrays; ESD Protection; 4-Channel; 17kV Air; 12kV Contact; 0.3pF Capitance; TBD; SMD; TBD;; Manufacturer: Semtech Corporation; MPN: RCLAMP0524PATCT; Component Type: IC; Component Subtype: TVS Arrays; Value: RCLAMP0524PA; Mounting Type: SMD; Package (Case): TBD; Supplier: ?; Supplier 1: LCSC; Supplier Part Number 1: C40960
X250 = OSC_XTL_P4: Oscillator; Crystal;; Value: 24.000MHz; Component Subtype: Crystal; Component Type: Crystal; Mounting Type: SMD; Supplier: ?; Supplier 1: LCSC; Supplier Part Number 1: C5261153

## Sheet [13] PWR1.SchDoc: Power supply
size A4; Engineer: M. Folejewski; DocumentNumber: 13; SheetNumber: 13; SheetTotal: 17; PageSize: A4; Designators: 900-949
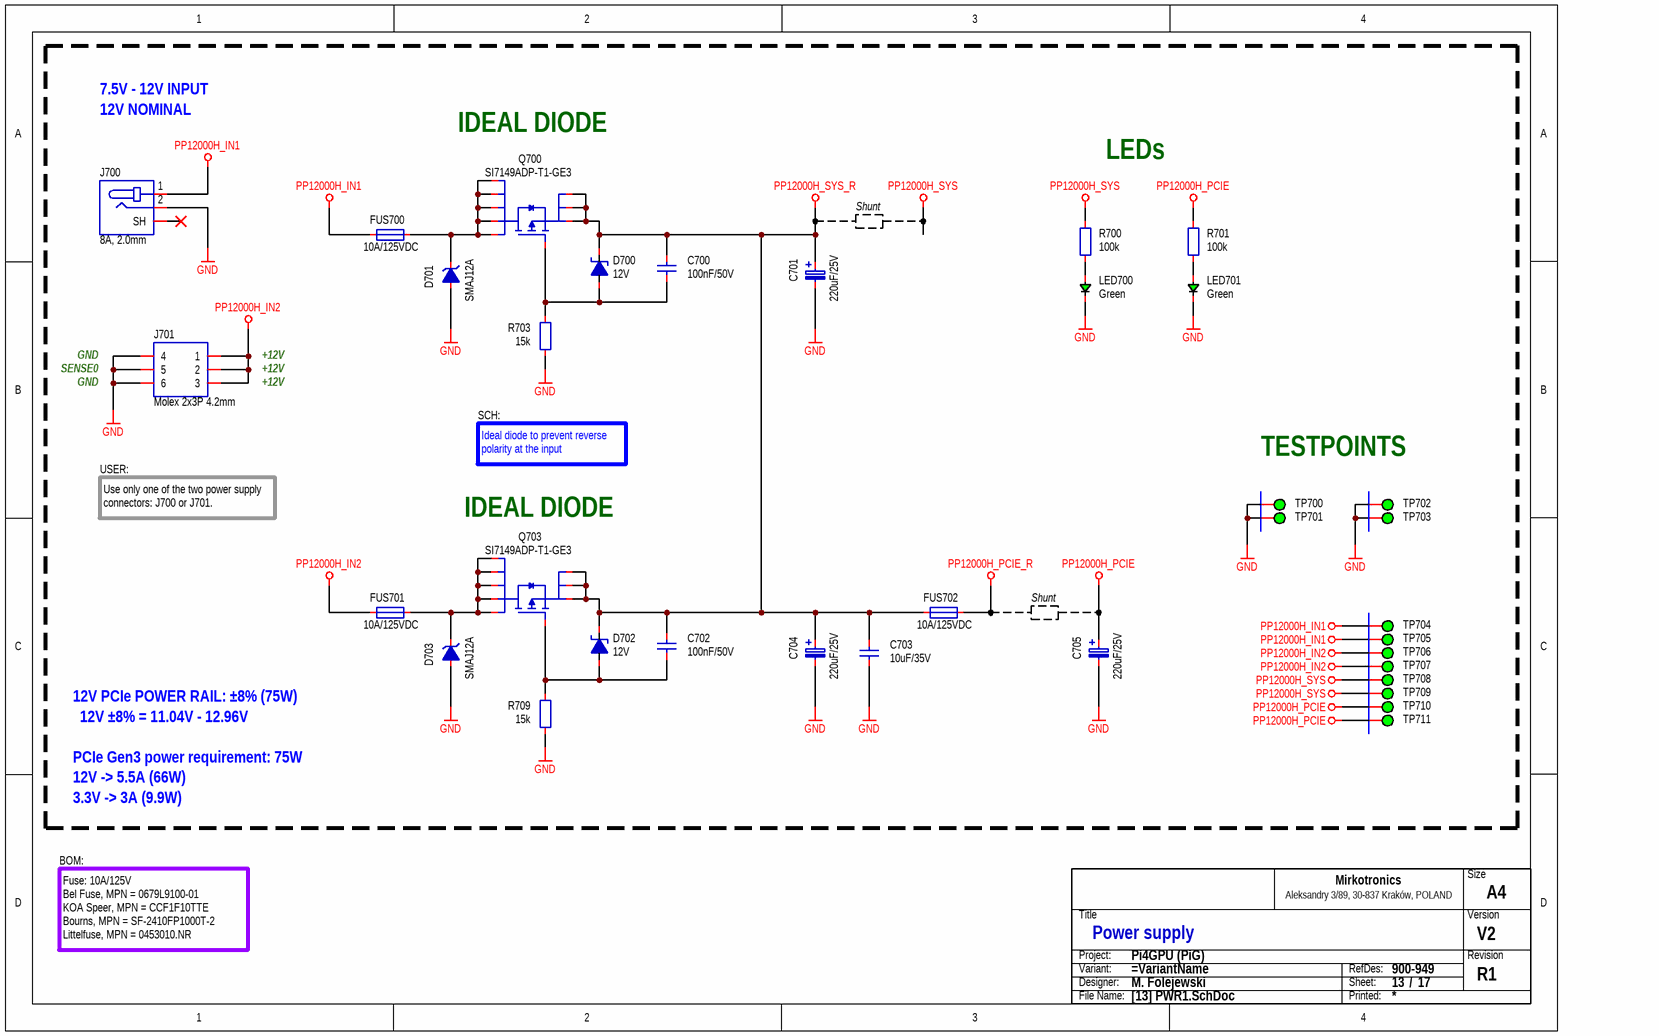
[diagram p15: [13] PWR1.SchDoc]

### Parts
(Parts that share a designator on the sheet are numbered #1, #2 ... from top to bottom, then left to right.)
C700  100nF/50V  [CAP_0603_R]
C701  220uF/25V  [CAP_SMD_SIZE_D8]
C702  100nF/50V  [CAP_0603_R]
C703  10uF/35V  [CAP_1206_R]
C704  220uF/25V  [CAP_SMD_SIZE_D8]
C705  220uF/25V  [CAP_SMD_SIZE_D8]
D700  12V  [PKG_SOT23-3_TO236]
D701  SMAJ12A  [DIO_SMA_UNI_R]
D702  12V  [PKG_SOT23-3_TO236]
D703  SMAJ12A  [DIO_SMA_UNI_R]
FUS700  10A/125VDC  [FUS_2410_R]
FUS701  10A/125VDC  [FUS_2410_R]
FUS702  10A/125VDC  [FUS_2410_R]
J700  8A, 2.0mm  [CON_CUI_PJ-063AH]
J701  Molex 2x3P 4.2mm  [CON_MLX_039301060]
LED700  Green  [LED_0805_GRN_R]
LED701  Green  [LED_0805_GRN_R]
Q700  MPN: SI7149ADP-T1-GE3  [ICC_SO8_POWERPAK_490X590X112_P127_R]  (hidden comment: PMOS)
Q703  MPN: SI7149ADP-T1-GE3  [ICC_SO8_POWERPAK_490X590X112_P127_R]  (hidden comment: PMOS)
R700  100k  [RES_0603_R]
R701  100k  [RES_0603_R]
R703  15k  [RES_0603_R]
R709  15k  [RES_0603_R]
TB?#16  Title block  (value not drawn)  (graphical)
TP700  ICT  [PCB_TP_ICT_100]  (value not drawn)  (no BOM)
TP701  ICT  [PCB_TP_ICT_100]  (value not drawn)  (no BOM)
TP702  ICT  [PCB_TP_ICT_100]  (value not drawn)  (no BOM)
TP703  ICT  [PCB_TP_ICT_100]  (value not drawn)  (no BOM)
TP704  ICT  [PCB_TP_ICT_100]  (value not drawn)  (no BOM)
TP705  ICT  [PCB_TP_ICT_100]  (value not drawn)  (no BOM)
TP706  ICT  [PCB_TP_ICT_100]  (value not drawn)  (no BOM)
TP707  ICT  [PCB_TP_ICT_100]  (value not drawn)  (no BOM)
TP708  ICT  [PCB_TP_ICT_100]  (value not drawn)  (no BOM)
TP709  ICT  [PCB_TP_ICT_100]  (value not drawn)  (no BOM)
TP710  ICT  [PCB_TP_ICT_100]  (value not drawn)  (no BOM)
TP711  ICT  [PCB_TP_ICT_100]  (value not drawn)  (no BOM)

### Nets
GND: C701.1 C703.1 C704.1 C705.1 D701.2(A) D703.2(A) J700.2 J701.4 J701.5 J701.6 LED700.1 LED701.1 R703.1 R709.1 TP700.1 TP701.1 TP702.1 TP703.1
PP12000H_IN1: FUS700.1 J700.1 TP704.1 TP705.1
PP12000H_IN2: FUS701.1 J701.1 J701.2 J701.3 TP706.1 TP707.1
PP12000H_PCIE: C705.2 R701.2 TP710.1 TP711.1
PP12000H_PCIE_R: FUS702.2
PP12000H_SYS: R700.2 TP708.1 TP709.1
PP12000H_SYS_R: C700.2 C701.2 C702.2 C703.2 C704.2 D700.3(K) D702.3(K) FUS702.1 Q700.1(S) Q700.2(S) Q700.3(S) Q703.1(S) Q703.2(S) Q703.3(S)
NetC700_1: C700.1 D700.1(A) Q700.4(G) R703.2
NetC702_1: C702.1 D702.1(A) Q703.4(G) R709.2
NetD701_1: D701.1(K) FUS700.2 Q700.5(D) Q700.6(D) Q700.7(D) Q700.8(D) Q700.EP(D)
NetD703_1: D703.1(K) FUS701.2 Q703.5(D) Q703.6(D) Q703.7(D) Q703.8(D) Q703.EP(D)
NetLED700_2: LED700.2 R700.1
NetLED701_2: LED701.2 R701.1

Not connected (* = marked no-connect by the designer): J700 SH*

### Notes on the sheet
- 7.5V - 12V INPUT
- 12V NOMINAL
- (near Q700) IDEAL DIODE
- LEDs
- Shunt
- GND
- SENSE0
- +12V
- SCH:
- Use only one of the two power supply connectors: J700 or J701.
- USER:
- (near Q703) IDEAL DIODE
- Ideal diode to prevent reverse polarity at the input
- TESTPOINTS
- 12V PCIe POWER RAIL: ±8% (75W)
- PCIe Gen3 power requirement: 75W
- 12V -> 5.5A (66W)
- 12V ±8% = 11.04V - 12.96V
- 3.3V -> 3A (9.9W)
- BOM:
- Fuse: 10A/125V
  Bel Fuse, MPN = 0679L9100-01
  KOA Speer, MPN = CCF1F10TTE
  Bourns, MPN = SF-2410FP1000T-2
  Littelfuse, MPN = 0453010.NR
- (in symbol SCH_TITLE_BLOCK_MIRKOTRONICS_V2) Size; Mirkotronics; Aleksandry 3/89, 30-837 Kraków, POLAND; Title; Version; Project:; Revision; Variant:; RefDes:; Designer:; Sheet:; /; File Name:; Printed:

### Library data of the parts
C700 C702 = CAP-0008: as C257-C260 on sheet [07] USB_HUB; Component Type: Capacitor; Component Subtype: MLCC; Value: 100nF/50V; Manufacturer: TBD; MPN: TBD; Mounting Type: SMD; Package (Case): 0603 (1608); Supplier: ?; Supplier 1: LCSC; Supplier Part Number 1: C14663
C701 C704 C705 = CAP_POL_2P_NP: Capacitor; Polarized;; Manufacturer: Panasonic; MPN: EEEFTE221XAP; Component Subtype: Electrolytic; Package (Case): SMD SIZE D8; Component Type: Capacitor; Mounting Type: SMD; Value: 220uF/25V; Supplier 1: LCSC; Supplier Part Number 1: C2918361
C703 = CAP-0025: as C251 on sheet [07] USB_HUB; Component Type: Capacitor; Component Subtype: MLCC; Value: 10uF/35V; Manufacturer: GENERIC; MPN: GENERIC; Mounting Type: SMD; Package (Case): 1206 (3216); Supplier: ?; Supplier 1: LCSC; Supplier Part Number 1: C92797
D700 D702 = DIO_ZEN_A_K: Diode; Zener;; MPN: MMBZ5242BLT3G; Manufacturer: ON Semi; Value: 12V; Supplier 1: LCSC; Supplier Part Number 1: C896784
D701 D703 = DIO_TVS_UNI_KA: Diode; Schottky; Unipolar;; Manufacturer: Littelfuse; Component Subtype: TVS Diode; Value: SMAJ12A; MPN: SMAJ12A; Component Type: Diode; Mounting Type: SMD; Supplier: ?; Supplier 1: LCSC; Supplier Part Number 1: C713694
FUS700-FUS702 = FUS: Fuse; Manufacturer: Bel Fuse; MPN: 0679L9100-01; Value: 10A/125VDC; Supplier 1: LCSC; Supplier Part Number 1: C2838934
J700 = CON_DC_A1_SH: Connector; DC Barrel Jack;; Manufacturer: CUI Devices; MPN: PJ-063AH; Package (Case): THT; Component Subtype: DC Barrel Jack; Component Type: Connector; Mounting Type: THT; Supplier 1: Mouser; Value: 8A, 2.0mm; Supplier Part Number 1: 490-PJ-063AH
J701 = CON_2X03_COL: Connector; 2 Row;; Component Subtype: Wire to Board; Package (Case): THT; Component Type: Connector; Manufacturer: Molex; Mounting Type: THT; MPN: 039-30-1060; Supplier 1: LCSC; Supplier Part Number 1: C54904; Value: Molex 2x3P 4.2mm
LED700 LED701 = DIO_LED_GRN: Diode; LED; Green;; Manufacturer: Foshan NationStar Optoelectronics; MPN: NCD0805G1; Component Subtype: LED Diode; Package (Case): 0805 (2012); Value: Green; Component Type: LED; Mounting Type: SMD; Supplier: LCSC; Supplier 1: LCSC; Supplier Part Number 1: C84260
Q700 Q703 = TRA_PMOS_SSSGDDDD_EP: Transistor; PMOS;; Manufacturer: Vishay; Component Subtype: P-MOSFET; Package (Case): PowerPAK-SO-8; Component Type: Transistor; Mounting Type: SMD; Supplier 1: LCSC; Supplier Part Number 1: C554002; Value: PMOS
R700 R701 = RES-0029: Resistor; Thick Film; 100k; 1%; 100mW; 100PPM; 75V; Standard; SMD; 0603 (1608);; Manufacturer: Yageo Corporation; MPN: TBD; Component Body: 1.60 x 0.80mm; Packaging Type: Tape & Reel; ID: RES-0029; Component Type: Resistor; Component Subtype: Thick Film; Value: 100k; Mounting Type: SMD; Package (Case): 0603 (1608); Component Height: 0.45mm; ROHS Status: RoHS Compliant; Operating Temperature: -55°C to +155°C; Resistance: 100k; Tolerance: 1%; Power Rating: 100mW; TCR: 100PPM; Voltage Rating: 75V; Features: Standard; Supplier 1: LCSC; Supplier Part Number 1: C25803
R703 R709 = RES-0043: Resistor; Thick Film; 15k; 1%; 100mW; 100PPM; 75V; Standard; SMD; 0603 (1608);; Manufacturer: Yageo Corporation; MPN: TBD; Component Type: Resistor; Component Subtype: Thick Film; Value: 15k; Mounting Type: SMD; Package (Case): 0603 (1608); Supplier: ?; Supplier 1: LCSC; Supplier Part Number 1: C22809
TB?#16 = SCH_TITLE_BLOCK_MIRKOTRONICS_V2: Component Type: Title block; Manufacturer: -; Mounting Type: Non component; MPN: -; Operating Temperature: -; Package: -; Specification: Title block; Value: Title block; Replacement: -; System: ?
TP700-TP711 = PCB_TP_ICT: as TP254 on sheet [07] USB_HUB; Component Type: Testpoint (for ICT); Manufacturer: -; Mounting Type: Non component; MPN: -; Value: ICT

## Sheet [14] PWR2.SchDoc: Power supply
size A4; Engineer: M. Folejewski; DocumentNumber: 14; SheetNumber: 14; SheetTotal: 17; PageSize: A4; Designators: 900-949
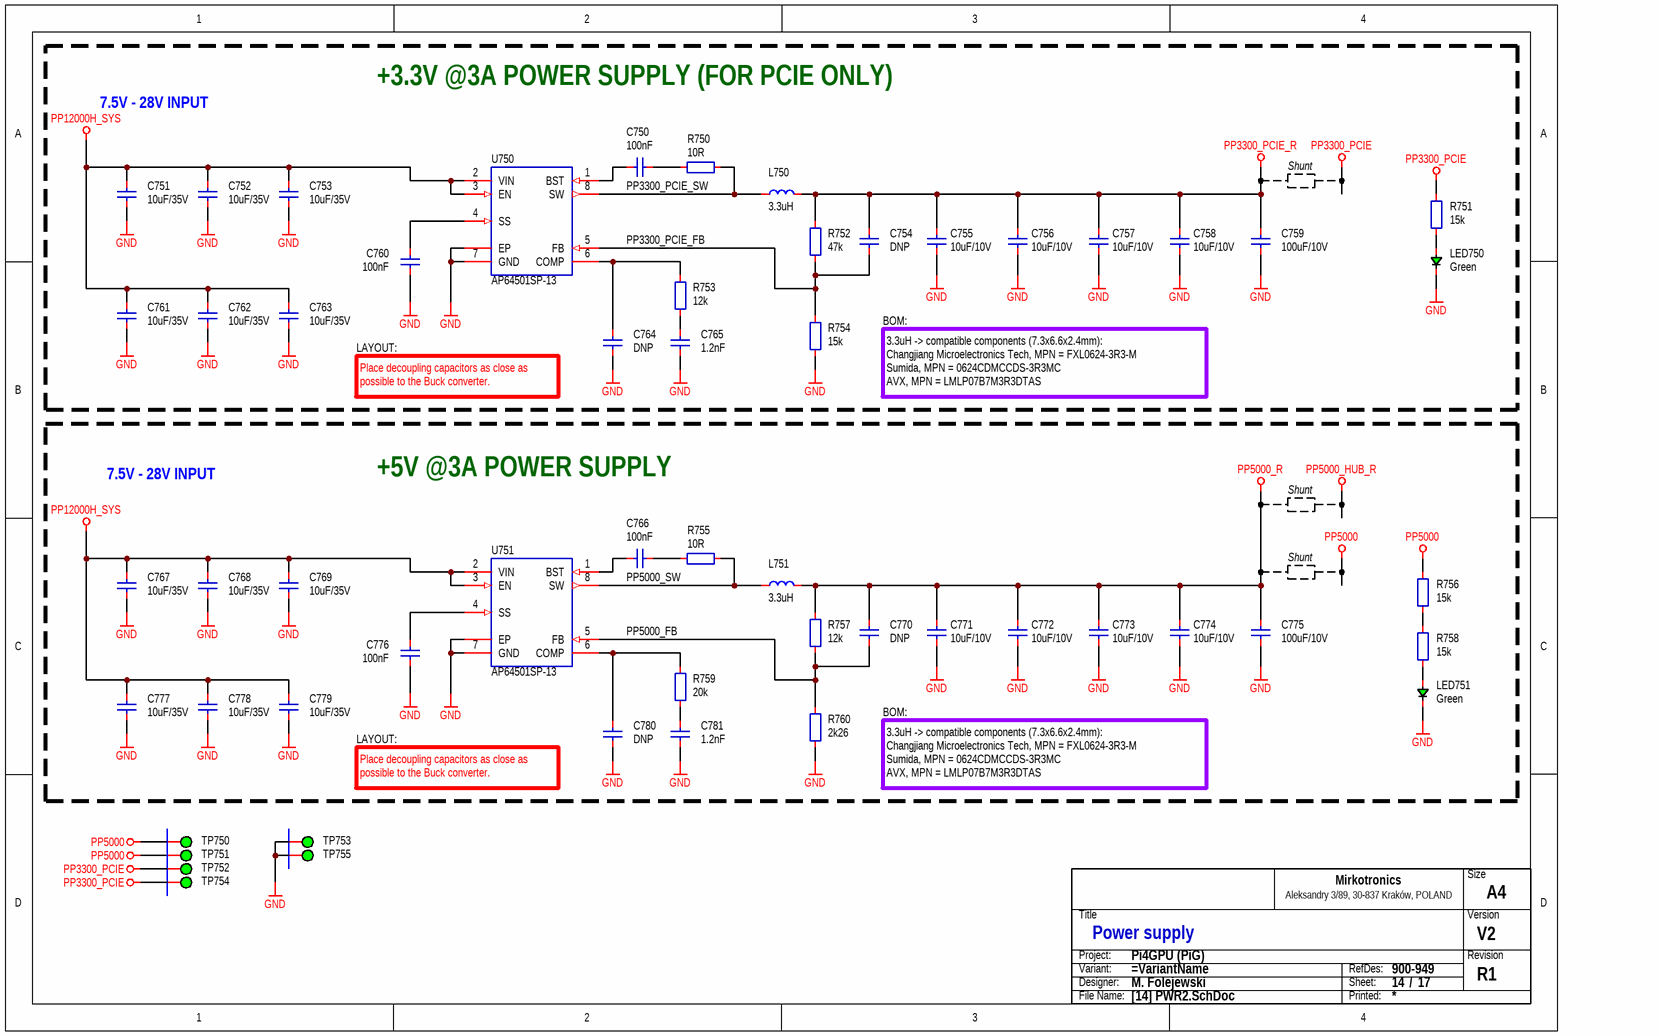
[diagram p16: [14] PWR2.SchDoc]

### Parts
(Parts that share a designator on the sheet are numbered #1, #2 ... from top to bottom, then left to right.)
C750  100nF  [CAP_0603_R]
C751  10uF/35V  [CAP_1206_R]
C752  10uF/35V  [CAP_1206_R]
C753  10uF/35V  [CAP_1206_R]
C754  DNP  [CAP_0603_R]
C755  10uF/10V  [CAP_0603_R]
C756  10uF/10V  [CAP_0603_R]
C757  10uF/10V  [CAP_0603_R]
C758  10uF/10V  [CAP_0603_R]
C759  100uF/10V  [CAP_1206_R]
C760  100nF  [CAP_0603_R]
C761  10uF/35V  [CAP_1206_R]
C762  10uF/35V  [CAP_1206_R]
C763  10uF/35V  [CAP_1206_R]
C764  DNP  [CAP_0603_R]
C765  1.2nF  [CAP_0603_R]
C766  100nF  [CAP_0603_R]
C767  10uF/35V  [CAP_1206_R]
C768  10uF/35V  [CAP_1206_R]
C769  10uF/35V  [CAP_1206_R]
C770  DNP  [CAP_0603_R]
C771  10uF/10V  [CAP_0603_R]
C772  10uF/10V  [CAP_0603_R]
C773  10uF/10V  [CAP_0603_R]
C774  10uF/10V  [CAP_0603_R]
C775  100uF/10V  [CAP_1206_R]
C776  100nF  [CAP_0603_R]
C777  10uF/35V  [CAP_1206_R]
C778  10uF/35V  [CAP_1206_R]
C779  10uF/35V  [CAP_1206_R]
C780  DNP  [CAP_0603_R]
C781  1.2nF  [CAP_0603_R]
L750  3.3uH  [IND_SUM_0624CDMCCDS_700X660X240_R]
L751  3.3uH  [IND_SUM_0624CDMCCDS_700X660X240_R]
LED750  Green  [LED_0805_GRN_R]
LED751  Green  [LED_0805_GRN_R]
R750  10R  [RES_0603_R]
R751  15k  [RES_0603_R]
R752  47k  [RES_0603_R]
R753  12k  [RES_0603_R]
R754  15k  [RES_0603_R]
R755  10R  [RES_0603_R]
R756  15k  [RES_0603_R]
R757  12k  [RES_0603_R]
R758  15k  [RES_0603_R]
R759  20k  [RES_0603_R]
R760  2k26  [RES_0603_R]
TB?#17  Title block  (value not drawn)  (graphical)
TP750  ICT  [PCB_TP_ICT_100]  (value not drawn)  (no BOM)
TP751  ICT  [PCB_TP_ICT_100]  (value not drawn)  (no BOM)
TP752  ICT  [PCB_TP_ICT_100]  (value not drawn)  (no BOM)
TP753  ICT  [PCB_TP_ICT_100]  (value not drawn)  (no BOM)
TP754  ICT  [PCB_TP_ICT_100]  (value not drawn)  (no BOM)
TP755  ICT  [PCB_TP_ICT_100]  (value not drawn)  (no BOM)
U750  AP64501SP-13  [ICC_SOIC8N_TP_R]
U751  AP64501SP-13  [ICC_SOIC8N_TP_R]

### Nets
GND: C751.1 C752.1 C753.1 C755.1 C756.1 C757.1 C758.1 C759.1 C760.1 C761.1 C762.1 C763.1 C764.1 C765.1 C767.1 C768.1 C769.1 C771.1 C772.1 C773.1 C774.1 C775.1 C776.1 C777.1 C778.1 C779.1 C780.1 C781.1 LED750.1 LED751.1 R754.1 R760.1 TP753.1 TP755.1 U750.7(GND) U750.EP U751.7(GND) U751.EP
PP3300_PCIE: R751.2 TP752.1 TP754.1
PP3300_PCIE_R: C754.2 C755.2 C756.2 C757.2 C758.2 C759.2 L750.2 R752.2
PP5000: R756.2 TP750.1 TP751.1
PP5000_R: C770.2 C771.2 C772.2 C773.2 C774.2 C775.2 L751.2 R757.2
PP12000H_SYS: C751.2 C752.2 C753.2 C761.2 C762.2 C763.2 C767.2 C768.2 C769.2 C777.2 C778.2 C779.2 U750.2(VIN) U750.3(EN) U751.2(VIN) U751.3(EN)
PP3300_PCIE_FB: C754.1 R752.1 R754.2 U750.5(FB)
PP3300_PCIE_SW: L750.1 R750.2 U750.8(SW)
PP5000_FB: C770.1 R757.1 R760.2 U751.5(FB)
PP5000_SW: L751.1 R755.2 U751.8(SW)
NetC750_1: C750.1 U750.1(BST)
NetC750_2: C750.2 R750.1
NetC760_2: C760.2 U750.4(SS)
NetC764_2: C764.2 R753.2 U750.6(COMP)
NetC765_2: C765.2 R753.1
NetC766_1: C766.1 U751.1(BST)
NetC766_2: C766.2 R755.1
NetC776_2: C776.2 U751.4(SS)
NetC780_2: C780.2 R759.2 U751.6(COMP)
NetC781_2: C781.2 R759.1
NetLED750_2: LED750.2 R751.1
NetLED751_2: LED751.2 R758.1
NetR756_1: R756.1 R758.2

### Notes on the sheet
- 7.5V - 28V INPUT
- +3.3V @3A POWER SUPPLY (FOR PCIE ONLY)
- Shunt
- LAYOUT:
- BOM:
- Place decoupling capacitors as close as possible to the Buck converter.
- 3.3uH -> compatible components (7.3x6.6x2.4mm):
  Changjiang Microelectronics Tech, MPN = FXL0624-3R3-M
  Sumida, MPN = 0624CDMCCDS-3R3MC
  AVX, MPN = LMLP07B7M3R3DTAS
- +5V @3A POWER SUPPLY
- (in symbol SCH_TITLE_BLOCK_MIRKOTRONICS_V2) Size; Mirkotronics; Aleksandry 3/89, 30-837 Kraków, POLAND; Title; Version; Project:; Revision; Variant:; RefDes:; Designer:; Sheet:; /; File Name:; Printed:

### Library data of the parts
C750 C760 C766 C776 = CAP-0008: as C257-C260 on sheet [07] USB_HUB; Component Type: Capacitor; Component Subtype: MLCC; Value: 100nF; Manufacturer: TBD; MPN: TBD; Mounting Type: SMD; Package (Case): 0603 (1608); Supplier: ?; Supplier 1: LCSC; Supplier Part Number 1: C14663
C751-C753 C759 C761-C763 C767-C769 C775 C777-C779 = CAP-0025: as C251 on sheet [07] USB_HUB; Component Type: Capacitor; Component Subtype: MLCC; Manufacturer: GENERIC; MPN: GENERIC; Mounting Type: SMD; Package (Case): 1206 (3216); Supplier: ?; Supplier 1: LCSC
  C751-C753 C761-C763 C767-C769 C777-C779: Value: 10uF/35V; Supplier Part Number 1: C92797
  C759 C775: Value: 100uF/10V; Supplier Part Number 1: C15008
C754-C758 C764 C765 C770-C774 C780 C781 = CAP-0023: as C250 on sheet [07] USB_HUB; Component Type: Capacitor; Component Subtype: MLCC; Manufacturer: GENERIC; MPN: GENERIC; Mounting Type: SMD; Package (Case): 0603 (1608); Supplier 1: LCSC
  C754 C764 C770 C780: ID: CAP-0023; Value: DNP; Component Body: TBD; Component Height: TBD; Packaging Type: TBD; ROHS Status: TBD; Operating Temperature: TBD; Capacitance: DNP; Voltage Rating: TBD; Dielectric: TBD; Tolerance: TBD; Features: TBD
  C755-C758 C771-C774: Value: 10uF/10V; Supplier: ?; Supplier Part Number 1: C19702
  C765 C781: ID: CAP-0023; Value: 1.2nF; Component Body: TBD; Component Height: TBD; Packaging Type: TBD; ROHS Status: TBD; Operating Temperature: TBD; Capacitance: 1.2nF; Voltage Rating: TBD; Dielectric: TBD; Tolerance: TBD; Features: TBD; Supplier Part Number 1: C1853470
L750 L751 = IND: Inductor;; Manufacturer: Changjiang Microelectronics Tech; MPN: FXL0624-3R3-M; Component Subtype: Power Inductor; Package (Case): SMD; Value: 3.3uH; Component Type: Inductor; Mounting Type: SMD; Supplier: ?; Supplier 1: LCSC; Supplier Part Number 1: C524605
LED750 LED751 = DIO_LED_GRN: as LED700 on sheet [13] PWR1; Value: Green; Component Type: LED; Mounting Type: SMD; Supplier: LCSC; Supplier 1: LCSC; Supplier Part Number 1: C84260
R750 R755 = RES-0025: Resistor; Thick Film; 10R; 1%; 100mW; 100PPM; 75V; Standard; SMD; 0603 (1608);; Manufacturer: Yageo Corporation; MPN: TBD; Component Body: 1.60 x 0.80mm; Packaging Type: Tape & Reel; ID: RES-0025; Component Type: Resistor; Component Subtype: Thick Film; Value: 10R; Mounting Type: SMD; Package (Case): 0603 (1608); Component Height: 0.45mm; ROHS Status: RoHS Compliant; Operating Temperature: -55°C to +155°C; Resistance: 10R; Tolerance: 1%; Power Rating: 100mW; TCR: 100PPM; Voltage Rating: 75V; Features: Standard; Supplier 1: LCSC; Supplier Part Number 1: C22859
R751 R756 R758 = RES-0043: as R703 on sheet [13] PWR1; Component Type: Resistor; Component Subtype: Thick Film; Value: 15k; Mounting Type: SMD; Package (Case): 0603 (1608); Supplier: ?; Supplier 1: LCSC; Supplier Part Number 1: C22809
R752 = RES-0044: Resistor; Thick Film; 47k; 1%; 100mW; 100PPM; 75V; Standard; SMD; 0603 (1608);; Manufacturer: Yageo Corporation; MPN: RC0603FR-0747KL; Component Body: 1.60 x 0.80mm; Packaging Type: Tape & Reel; ID: RES-0044; Component Type: Resistor; Component Subtype: Thick Film; Value: 47k; Mounting Type: SMD; Package (Case): 0603 (1608); Component Height: 0.45mm; ROHS Status: RoHS Compliant; Operating Temperature: -55°C to +155°C; Resistance: 47k; Tolerance: 1%; Power Rating: 100mW; TCR: 100PPM; Voltage Rating: 75V; Features: Standard; Supplier 1: LCSC; Supplier Part Number 1: C25819
R753 R757 = RES-0053: Resistor; Thick Film; 12k; 1%; 100mW; 100PPM; 75V; Standard; SMD; 0603 (1608);; Manufacturer: Yageo Corporation; MPN: TBD; Component Body: 1.60 x 0.80mm; Packaging Type: Tape & Reel; ID: RES-0053; Component Type: Resistor; Component Subtype: Thick Film; Value: 12k; Mounting Type: SMD; Package (Case): 0603 (1608); Component Height: 0.45mm; ROHS Status: RoHS Compliant; Operating Temperature: -55°C to +155°C; Resistance: 12k; Tolerance: 1%; Power Rating: 100mW; TCR: 100PPM; Voltage Rating: 75V; Features: Standard; Supplier 1: LCSC; Supplier Part Number 1: C22790
R754 R759 = RES-0054: Resistor; Thick Film; GENERIC; TBD; TBD; TBD; TBD; TBD; SMD; 0603 (1608);; Component Body: 1.60 x 0.80mm; ID: RES-0054; Component Type: Resistor; Component Subtype: Thick Film; Manufacturer: GENERIC; MPN: GENERIC; Mounting Type: SMD; Package (Case): 0603 (1608); Component Height: TBD; Packaging Type: TBD; ROHS Status: TBD; Operating Temperature: TBD; Tolerance: TBD; Power Rating: TBD; TCR: TBD; Voltage Rating: TBD; Features: TBD; Supplier 1: LCSC
  R754: Value: 15k; Resistance: 15k; Supplier Part Number 1: C22809
  R759: Value: 20k; Resistance: 20k; Supplier Part Number 1: C4184
R760 = RES-0033: Resistor; Thick Film; 2k26; 1%; 100mW; 100PPM; 75V; Standard; SMD; 0603 (1608);; Manufacturer: Yageo Corporation; MPN: TBD; Component Body: 1.60 x 0.80mm; Packaging Type: Tape & Reel; ID: RES-0033; Component Type: Resistor; Component Subtype: Thick Film; Value: 2k26; Mounting Type: SMD; Package (Case): 0603 (1608); Component Height: 0.45mm; ROHS Status: RoHS Compliant; Operating Temperature: -55°C to +155°C; Resistance: 2k26; Tolerance: 1%; Power Rating: 100mW; TCR: 100PPM; Voltage Rating: 75V; Features: Standard; Supplier 1: LCSC; Supplier Part Number 1: C22904
TB?#17 = SCH_TITLE_BLOCK_MIRKOTRONICS_V2: Component Type: Title block; Manufacturer: -; Mounting Type: Non component; MPN: -; Operating Temperature: -; Package: -; Specification: Title block; Value: Title block; Replacement: -; System: ?
TP750-TP755 = PCB_TP_ICT: as TP254 on sheet [07] USB_HUB; Component Type: Testpoint (for ICT); Manufacturer: -; Mounting Type: Non component; MPN: -; Value: ICT
U750 U751 = ICC_DDI_AP64501_SO8_EP: IC; Buck regulator;; Manufacturer: Diodes Incorporated; Specification: Synchronous step-down DC-DC converter, 3.8V to 40V input, 5A, 570kHz, SOIC8 package; Component Type: IC; Mounting Type: SMD; MPN: AP64501SP-13; Operating Temperature: -40°C to +85°C; Package: SOIC8; Value: AP64501SP-13; Supplier 1: LCSC; Supplier Part Number 1: C2071517

## Nets that join several sheets
GND: [04] CM4_PART1 (74 pins), [08] PCIe (21 pins), [06] USB_C (16 pins), [10] Ethernet (7 pins), [11] SD (9 pins), [16] PCB_Mech (MH904.MH MH905.MH MH906.MH MH907.MH), [15] Sensors (16 pins), [12] MISC (7 pins), [09] HDMI (13 pins), [07] USB_HUB (37 pins), [13] PWR1 (18 pins), [14] PWR2 (38 pins)
PP3300: [04] CM4_PART1 (12 pins), [06] USB_C (C200.2 SW200.3 U200.1), [10] Ethernet (J400.11 J400.14), [11] SD (C450.2 R450.2 U450.1), [15] Sensors (12 pins), [12] MISC (C500.2 R500.2 U500.3), [07] USB_HUB (8 pins)
PP3300_PCIE: [08] PCIe (10 pins), [15] Sensors (R806.2 R809.2), [14] PWR2 (R751.2 TP752.1 TP754.1)
PP3300_PCIE_R: [15] Sensors (R806.1 R808.2), [14] PWR2 (8 pins)
PP5000: [04] CM4_PART1 (9 pins), [15] Sensors (R800.2 R803.2), [12] MISC (J500.1 J502.3), [09] HDMI (C350.2 R350.2 U352.3), [14] PWR2 (R756.2 TP750.1 TP751.1)
PP5000_HUB_R: [15] Sensors (R812.2 R814.2), [07] USB_HUB (C250.2 U250.1)
PP5000_R: [15] Sensors (R800.1 R802.2 R812.1 R813.2), [14] PWR2 (8 pins)
PP12000H_PCIE: [08] PCIe (5 pins), [15] Sensors (R807.2 R811.2), [13] PWR1 (C705.2 R701.2 TP710.1 TP711.1)
PP12000H_PCIE_R: [15] Sensors (R807.1 R810.2), [13] PWR1 (FUS702.2)
PP12000H_SYS: [15] Sensors (R801.2 R805.2), [12] MISC (J502.1), [13] PWR1 (R700.2 TP708.1 TP709.1), [14] PWR2 (16 pins)
PP12000H_SYS_R: [15] Sensors (R801.1 R804.2), [13] PWR1 (14 pins)
BOOT_MODE: [04] CM4_PART1 (MOD100.93 TP104.1), [06] USB_C (Q200.3 TP201.1)
CM_GPIO2: [04] CM4_PART1 (J100.3 MOD100.58), [15] Sensors (6 pins), [12] MISC (U500.1)
CM_GPIO3: [04] CM4_PART1 (J100.5 MOD100.56), [15] Sensors (6 pins), [12] MISC (U500.2)
CM_GPIO12: [04] CM4_PART1 (J100.32 MOD100.31), [12] MISC (Q500.1)
CM_GPIO22: [04] CM4_PART1 (J100.15 MOD100.46), [12] MISC (R501.1)
CM_GPIO27: [04] CM4_PART1 (J100.13 MOD100.48), [12] MISC (R502.1)
CM_HDMI0_CEC: [05] CM4_PART2 (MOD100.151), [09] HDMI (J350.13 TP350.1)
CM_HDMI0_CLK_N: [05] CM4_PART2 (MOD100.190), [09] HDMI (J350.12 U350.1 U350.10)
CM_HDMI0_CLK_P: [05] CM4_PART2 (MOD100.188), [09] HDMI (J350.10 U350.2 U350.9)
CM_HDMI0_D0_N: [05] CM4_PART2 (MOD100.184), [09] HDMI (J350.9 U350.4 U350.7)
CM_HDMI0_D0_P: [05] CM4_PART2 (MOD100.182), [09] HDMI (J350.7 U350.5 U350.6)
CM_HDMI0_D1_N: [05] CM4_PART2 (MOD100.178), [09] HDMI (J350.6 U351.1 U351.10)
CM_HDMI0_D1_P: [05] CM4_PART2 (MOD100.176), [09] HDMI (J350.4 U351.2 U351.9)
CM_HDMI0_D2_N: [05] CM4_PART2 (MOD100.172), [09] HDMI (J350.3 U351.4 U351.7)
CM_HDMI0_D2_P: [05] CM4_PART2 (MOD100.170), [09] HDMI (J350.1 U351.5 U351.6)
CM_HDMI0_HPD: [05] CM4_PART2 (MOD100.153), [09] HDMI (J350.19 TP353.1)
CM_HDMI0_SCL: [05] CM4_PART2 (MOD100.200), [09] HDMI (J350.15 TP351.1)
CM_HDMI0_SDA: [05] CM4_PART2 (MOD100.199), [09] HDMI (J350.16 TP352.1)
CM_SD_CLK: [05] CM4_PART2 (MOD100.57), [11] SD (J450.5 TP452.1)
CM_SD_CMD: [05] CM4_PART2 (MOD100.62), [11] SD (J450.3 TP450.1)
CM_SD_DAT0: [05] CM4_PART2 (MOD100.63), [11] SD (J450.7)
CM_SD_DAT1: [05] CM4_PART2 (MOD100.67), [11] SD (J450.8)
CM_SD_DAT2: [05] CM4_PART2 (MOD100.69), [11] SD (J450.1)
CM_SD_DAT3: [05] CM4_PART2 (MOD100.61), [11] SD (J450.2)
CM_SD_PWR_ON: [05] CM4_PART2 (MOD100.75), [11] SD (TP453.1 U450.3)
CM_USB_D_N: [05] CM4_PART2 (MOD100.103), [06] USB_C (U200.4)
CM_USB_D_P: [05] CM4_PART2 (MOD100.105), [06] USB_C (U200.3)
CM_USB_OTG: [05] CM4_PART2 (MOD100.101), [06] USB_C (R200.2)
ETH_D0_N: [05] CM4_PART2 (MOD100.10), [10] Ethernet (J400.3 U400.2 U400.9)
ETH_D0_P: [05] CM4_PART2 (MOD100.12), [10] Ethernet (J400.2 U400.1 U400.10)
ETH_D1_N: [05] CM4_PART2 (MOD100.6), [10] Ethernet (J400.7 U400.5 U400.6)
ETH_D1_P: [05] CM4_PART2 (MOD100.4), [10] Ethernet (J400.4 U400.4 U400.7)
ETH_D2_N: [05] CM4_PART2 (MOD100.9), [10] Ethernet (J400.6 U401.2 U401.9)
ETH_D2_P: [05] CM4_PART2 (MOD100.11), [10] Ethernet (J400.5 U401.1 U401.10)
ETH_D3_N: [05] CM4_PART2 (MOD100.5), [10] Ethernet (J400.9 U401.5 U401.6)
ETH_D3_P: [05] CM4_PART2 (MOD100.3), [10] Ethernet (J400.8 U401.4 U401.7)
ETH_LED_nACT: [05] CM4_PART2 (MOD100.15), [10] Ethernet (R400.1 TP400.1)
ETH_LED_nSPD: [05] CM4_PART2 (MOD100.17), [10] Ethernet (R401.1 TP401.1)
PCIe_CLK_N: [05] CM4_PART2 (MOD100.112), [08] PCIe (J300.A14)
PCIe_CLK_P: [05] CM4_PART2 (MOD100.110), [08] PCIe (J300.A13)
PCIe_nCLKREQ: [05] CM4_PART2 (MOD100.102), [08] PCIe (J300.B12 R301.2 TP300.1)
PCIe_nRST: [05] CM4_PART2 (MOD100.109), [08] PCIe (J300.A11 R300.2 TP301.1)
PCIe_RX_N: [05] CM4_PART2 (MOD100.118), [08] PCIe (J300.A16)
PCIe_RX_P: [05] CM4_PART2 (MOD100.116), [08] PCIe (J300.A17)
PCIe_TX_N: [05] CM4_PART2 (MOD100.124), [08] PCIe (J300.B14)
PCIe_TX_P: [05] CM4_PART2 (MOD100.122), [08] PCIe (J300.B15)
SYS_nRST: [04] CM4_PART1 (C100.2 R100.2 R103.2 TP103.1), [07] USB_HUB (R258.2)
USB-H_N: [06] USB_C (U200.6), [07] USB_HUB (U251.30)
USB-H_P: [06] USB_C (U200.7), [07] USB_HUB (U251.31)

## Assembly variants
STD: not fitted C100 C264 C265 C268 C450 C754 C764 C770 C780 C800 C801 C804 C805 C808 MECH900 MECH901 MECH902 MECH903 Q450 Q451 R257 R300 R301 R350 R451 R452 R503 R900 SCR900 SCR901 SCR902 SCR903 U450
LITE: not fitted C100 C264 C265 C268 C450 C500 C754 C764 C770 C780 C800 C801 C802 C804 C805 C806 C807 C808 C809 J501 J502 MECH900 MECH901 MECH902 MECH903 Q450 Q451 R257 R300 R301 R350 R451 R452 R500 R503 R802 R803 R804 R805 R808 R809 R810 R811 R813 R814 R901 SCR900 SCR901 SCR902 SCR903 U450 U500 U800 U801 U802 U803 U804